# EAGLE design 1u_panel (EAGLE 9.6.2)

## Sheet 1 of 2: MPPT / PWR
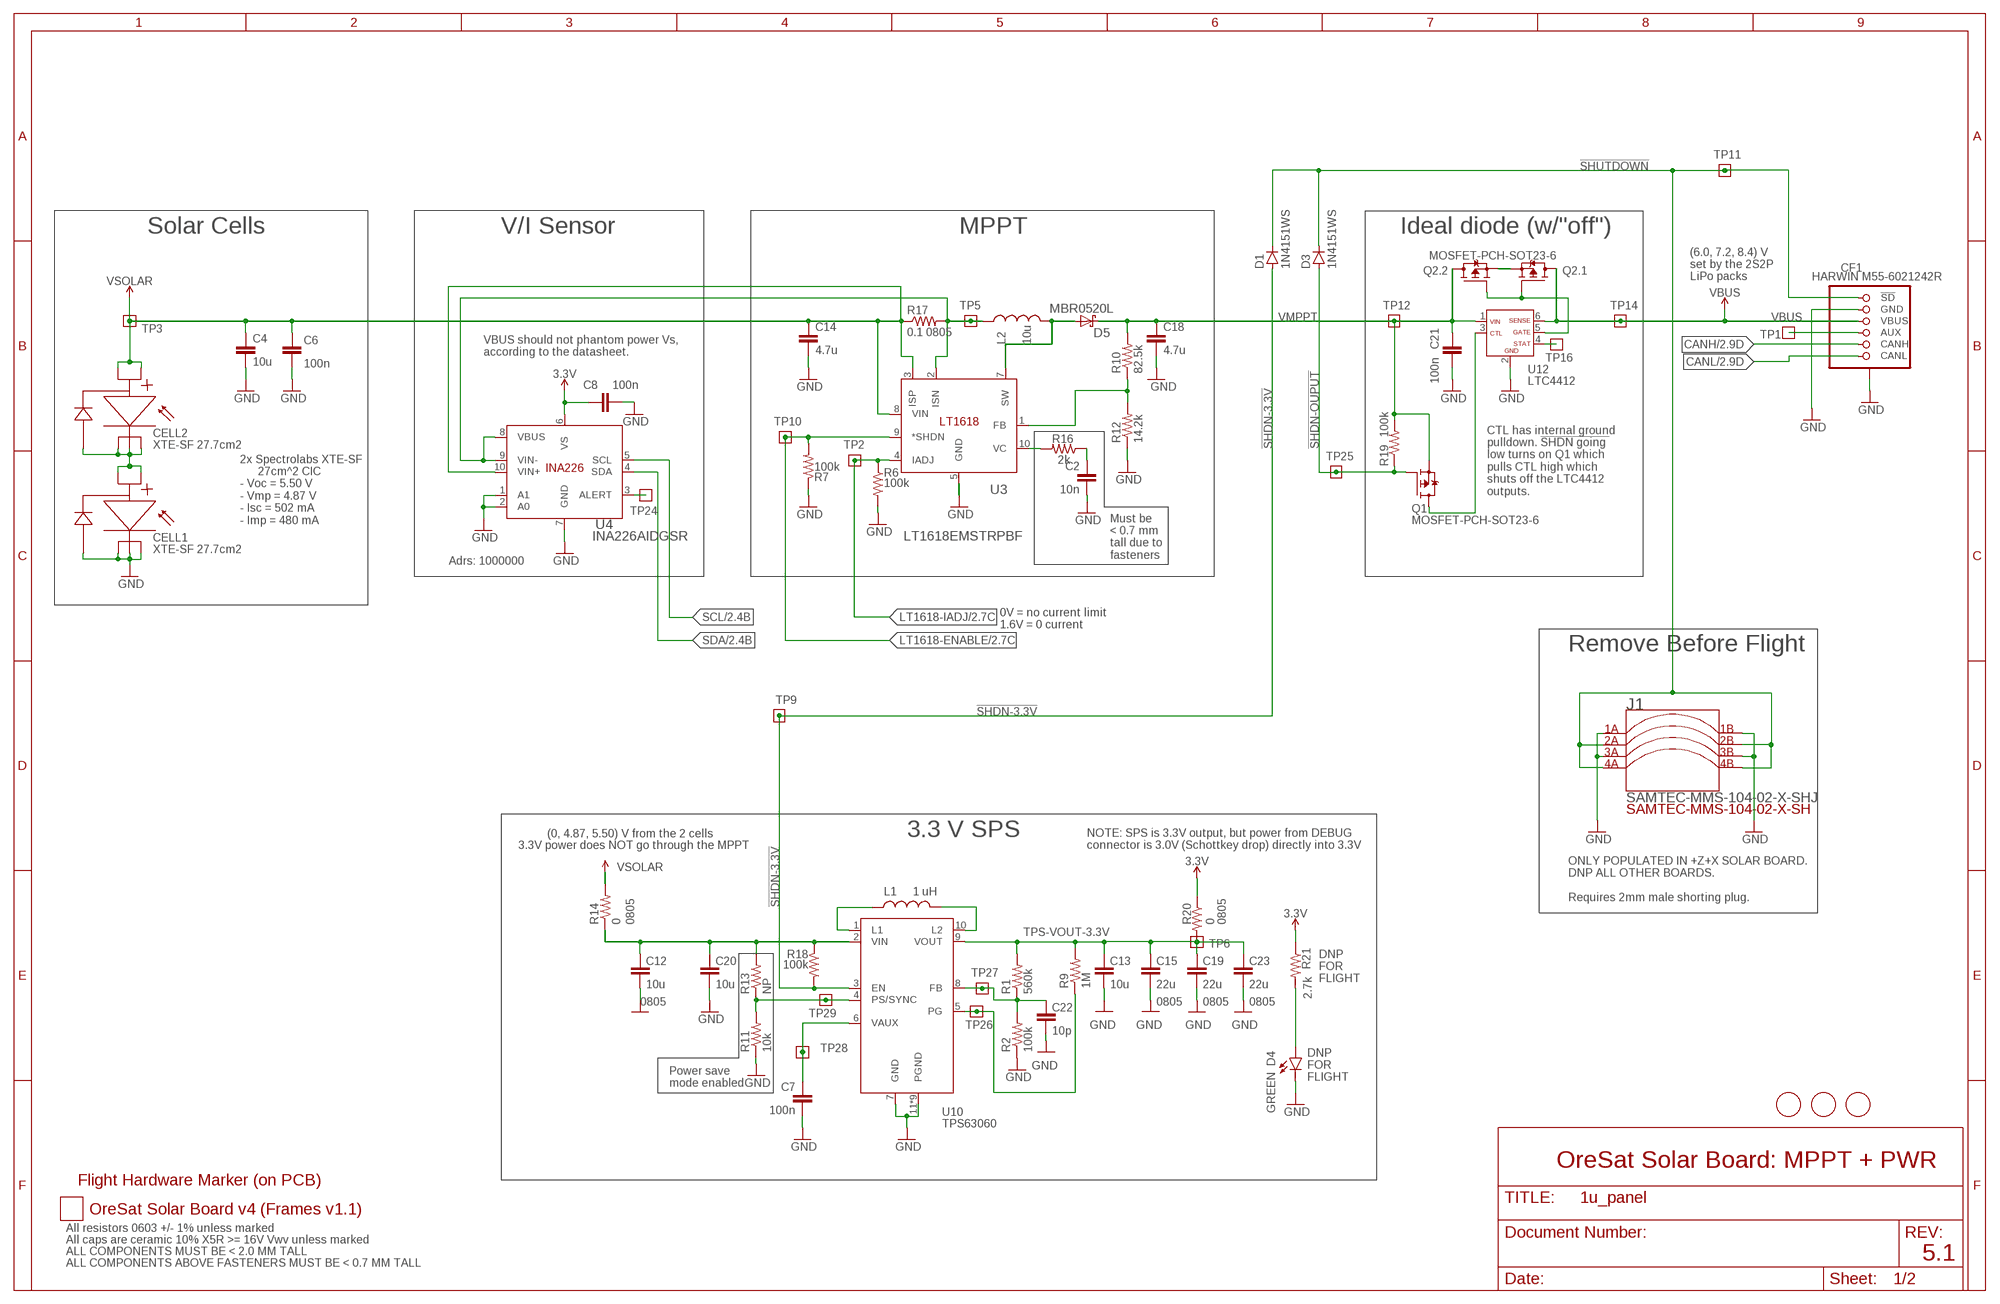
[diagram p0: schematic, sheet 1]

### Parts
C2  10n  C-EU0603-C-NOSILK  [.0603-C-NOSILK]
C4  10u  C-EU0603-C-NOSILK  [.0603-C-NOSILK]
C6  100n  C-EU0603-C-NOSILK  [.0603-C-NOSILK]
C7  100n  C-EU0603-C-NOSILK  [.0603-C-NOSILK]
C8  100n  C-EU0603-C-NOSILK  [.0603-C-NOSILK]
C12  10u  C-EU0805-B-NOSILK  [.0805-B-NOSILK]
C13  10u  C-EU0603-C-NOSILK  [.0603-C-NOSILK]
C14  4.7u  C-EU0603-C-NOSILK  [.0603-C-NOSILK]
C15  22u  C-EU0805-B-NOSILK  [.0805-B-NOSILK]
C18  4.7u  C-EU0603-C-NOSILK  [.0603-C-NOSILK]
C19  22u  C-EU0805-B-NOSILK  [.0805-B-NOSILK]
C20  10u  C-EU0603-C-NOSILK  [.0603-C-NOSILK]
C21  100n  C-EU0402-B-NOSILK  [.0402-B-NOSILK]
C22  10p  C-EU0603-C-NOSILK  [.0603-C-NOSILK]
C23  22u  C-EU0805-B-NOSILK  [.0805-B-NOSILK]
CELL1  XTE-SF 27.7cm2  SPECTROLAB-XTE-SF  [SPECTROLAB-XTE-SF]
CELL2  XTE-SF 27.7cm2  SPECTROLAB-XTE-SF  [SPECTROLAB-XTE-SF]
CF1  HARWIN M55-6021242R  SOLAR-BOARD-CONNECTOR  [HARWIN-M55-60X1242R]
D1  1N4151WS  DIODE-SOD323-R  [SOD323-R]
D3  1N4151WS  DIODE-SOD323-R  [SOD323-R]
D4  GREEN  LED-GREEN0603  [LED-0603]
D5  MBR0520L  NRVB130TGSOD123  [SOD123]
J1  SAMTEC-MMS-104-02-X-SHJ  [SAMTEC-MMS-104-02-X-SH]
L1  1 uH  L-MURATA-1226AS-H-1R0N=P2  [IND_1226AS-H-1R0N=P2]
L2  10u  L-WURTH-744042100  [NONSTANDARD]
PCB1  ORESAT-SOLAR-BOARD-V4-SPECTROLABS  [ORESAT-SOLAR-BOARD-V4]
Q1  MOSFET-PCH-SOT23-6  [SOT23-6]
Q2  MOSFET-PCH-SOT23-6  [SOT23-6]
R1  560k  R-US_0603-C-NOSILK  [.0603-C-NOSILK]
R2  100k  R-US_0603-C-NOSILK  [.0603-C-NOSILK]
R6  100k  R-US_0603-C-NOSILK  [.0603-C-NOSILK]
R7  100k  R-US_0603-C-NOSILK  [.0603-C-NOSILK]
R9  1M  R-US_0603-C-NOSILK  [.0603-C-NOSILK]
R10  82.5k  R-US_0603-C-NOSILK  [.0603-C-NOSILK]
R11  10k  R-US_0603-C-NOSILK  [.0603-C-NOSILK]
R12  14.2k  R-US_0603-C-NOSILK  [.0603-C-NOSILK]
R13  NP  R-US_0603-C-NOSILK  [.0603-C-NOSILK]
R14  0  R-US_0805-C-NOSILK  [.0805-C-NOSILK]
R16  2k  R-US_0603-C-NOSILK  [.0603-C-NOSILK]
R17  0.1 0805  R-US_0805-C-NOSILK  [.0805-C-NOSILK]
R18  100k  R-US_0603-C-NOSILK  [.0603-C-NOSILK]
R19  100k  R-US_0603-C-NOSILK  [.0603-C-NOSILK]
R20  0  R-US_0805-C-NOSILK  [.0805-C-NOSILK]
R21  2.7k  R-US_0603-C-NOSILK  [.0603-C-NOSILK]
TP1  TEST-POINT-LARGE-SQUARE  [1X01]
TP2  TEST-POINT-LARGE-SQUARE  [1X01]
TP3  TEST-POINT-LARGE-SQUARE  [1X01]
TP5  TEST-POINT-LARGE-SQUARE  [1X01]
TP6  TEST-POINT-LARGE-SQUARE  [1X01]
TP9  TEST-POINT-LARGE-SQUARE  [1X01]
TP10  TEST-POINT-LARGE-SQUARE  [1X01]
TP11  TEST-POINT-LARGE-SQUARE  [1X01]
TP12  TEST-POINT-LARGE-SQUARE  [1X01]
TP14  TEST-POINT-LARGE-SQUARE  [1X01]
TP16  TEST-POINT-LARGE-SQUARE  [1X01]
TP24  TEST-POINT-LARGE-SQUARE  [1X01]
TP25  TEST-POINT-LARGE-SQUARE  [1X01]
TP26  TEST-POINT-LARGE-SQUARE  [1X01]
TP27  TEST-POINT-LARGE-SQUARE  [1X01]
TP28  TEST-POINT-LARGE-SQUARE  [1X01]
TP29  TEST-POINT-LARGE-SQUARE  [1X01]
U3  LT1618EMSTRPBF  [MSOP-10_MS]
U4  INA226AIDGSR  [DGS10]
U10  TPS63060  U-TI-TPS63060DCT-BUCKBOOST  [CONV_TPS63060DSCT]
U12  LTC4412  [SOT23-6]
U$1  FLIGHMARKERNEW  [FLIGHTMARKER_NEW_BOARDS]
U$2  FIDUCIAL  [FIDUCIAL_1MM]
U$3  FIDUCIAL  [FIDUCIAL_1MM]
U$4  FIDUCIAL  [FIDUCIAL_1MM]

### Nets
3.3V: C8.1 R20.1 R21.1 U4.6(VS) ; also sheet 2
4412-CTL: Q1.1(D) Q1.2(D) Q1.5(D) Q1.6(D) U12.3(CTL)
4412-GATE: Q2.1(.1:G) Q2.3(.2:G) U12.5(GATE)
!SHDN-3.3V: D1.A R18.2 TP9.1 U10.3(EN)
!SHDN-OUPUT: D3.A Q1.3(G) R19.1 TP25.1
!SHUTDOWN: CF1.1(!SD) CF1.2(!SD) D1.C D3.C J1.2A J1.2B J1.4A J1.4B TP11.1
AUX: CF1.7(AUX) CF1.8(AUX) TP1.1
CANH: CF1.9(CANH) CF1.10(CANH) ; also sheet 2
CANL: CF1.11(CANL) CF1.12(CANL) ; also sheet 2
GND: C2.2 C4.2 C6.2 C7.2 C8.2 C12.2 C13.2 C14.2 C15.2 C18.2 C19.2 C20.2 C21.2 C22.2 C23.2 CELL1.NEG1(C1) CELL1.NEG2(C2) CELL1.NEG3(C3) CELL1.NEG4(C4) CF1.3(GND) CF1.4(GND) CF1.P$1(SHIELD) CF1.P$2(SHIELD) CF1.P$3(SHIELD) CF1.P$4(SHIELD) D4.C J1.1A J1.1B J1.3A J1.3B R2.1 R6.2 R7.1 R11.1 R12.1 U3.5(GND) U4.1(A1) U4.2(A0) U4.7(GND) U10.7(GND) U10.11(PGND) U10.12(PGND) U10.13(PGND) U10.14(PGND) U10.15(PGND) U10.16(PGND) U10.17(PGND) U10.18(PGND) U10.19(PGND) U12.2(GND) ; also sheet 2
INTERCELL: CELL1.POS1(A1) CELL1.POS2(A2) CELL2.NEG1(C1) CELL2.NEG2(C2) CELL2.NEG3(C3) CELL2.NEG4(C4)
LT1618-ENABLE: R7.2 TP10.1 U3.9(*SHDN) ; also sheet 2
LT1618-FB: R10.1 R12.2 U3.1(FB)
LT1618-IADJ: R6.1 TP2.1 U3.4(IADJ) ; also sheet 2
LT1618-ISN: L2.P$1 R17.2 TP5.1 U3.2(ISN) U4.8(VBUS) U4.9(VIN-)
LT1618-SW: D5.A(ANODE) L2.P$2 U3.7(SW)
LT1618-VC: R16.2 U3.10(VC)
N$7: TP24.1 U4.3(ALERT)
N$10: C2.1 R16.1
N$11: TP16.1 U12.4(STAT)
N$13: Q2.2(.2:S) Q2.5(.1:S)
N$14: D4.A R21.2
SCL: U4.5(SCL) ; also sheet 2
SDA: U4.4(SDA) ; also sheet 2
TPS-EN: R11.2 R13.1 TP29.1 U10.4(PS/SYNC)
TPS-FB: C22.1 R1.1 R2.2 TP27.1 U10.8(FB)
TPS-L1: L1.1 U10.1(L1)
TPS-L2: L1.2 U10.10(L2)
TPS-PG: R9.1 TP26.1 U10.5(PG)
TPS-VAUX: C7.1 TP28.1 U10.6(VAUX)
TPS-VIN: C12.1 C20.1 R13.2 R14.1 R18.1 U10.2(VIN)
TPS-VOUT-3.3V: C13.1 C15.1 C19.1 C23.1 R1.2 R9.2 R20.2 TP6.1 U10.9(VOUT)
VBUS: CF1.5(VBUS) CF1.6(VBUS) Q2.6(.1:D) TP14.1 U12.6(SENSE)
VMPPT: C18.1 C21.1 D5.K(CATHODE) Q1.4(S) Q2.4(.2:D) R10.2 R19.2 TP12.1 U12.1(VIN)
VSOLAR: C4.1 C6.1 C14.1 CELL2.POS1(A1) CELL2.POS2(A2) R14.2 R17.1 TP3.1 U3.3(ISP) U3.8(VIN) U4.10(VIN+)

### Notes on the sheet
- Solar Cells | V/I Sensor | MPPT | Ideal diode (w/"off")
- (6.0, 7.2, 8.4) V
  set by the 2S2P 
  LiPo packs
- VBUS should not phantom power Vs,
  according to the datasheet.
- CTL has internal ground
  pulldown. !SHDN going 
  low turns on Q1 which 
  pulls CTL high which 
  shuts off the LTC4412 
  outputs.
- 2x Spectrolabs XTE-SF 
        27cm^2 CIC
  - Voc = 5.50 V
  - Vmp = 4.87 V
  - Isc = 502 mA
  - Imp = 480 mA
- Must be 
  < 0.7 mm
  tall due to
  fasteners
- Adrs: 1000000
- 0V = no current limit
  1.6V = 0 current
- Remove Before Flight
- (0, 4.87, 5.50) V from the 2 cells | 3.3 V SPS
- 3.3V power does NOT go through the MPPT
- NOTE: SPS is 3.3V output, but power from DEBUG
  connector is 3.0V (Schottkey drop) directly into 3.3V
- ONLY POPULATED IN +Z+X SOLAR BOARD.
  DNP ALL OTHER BOARDS.
  
  Requires 2mm male shorting plug.
- 0805 | 0805
- DNP
  FOR
  FLIGHT
- 0805 | 0805 | 0805 | 0805
- DNP
  FOR
  FLIGHT
- Power save
  mode enabled
- OreSat Solar Board: MPPT + PWR
- All resistors 0603 +/- 1% unless marked
- All caps are ceramic 10% X5R >= 16V Vwv unless marked
- ALL COMPONENTS MUST BE < 2.0 MM TALL
- 5.1
- ALL COMPONENTS ABOVE FASTENERS MUST BE < 0.7 MM TALL

## Sheet 2 of 2: Microcontroller
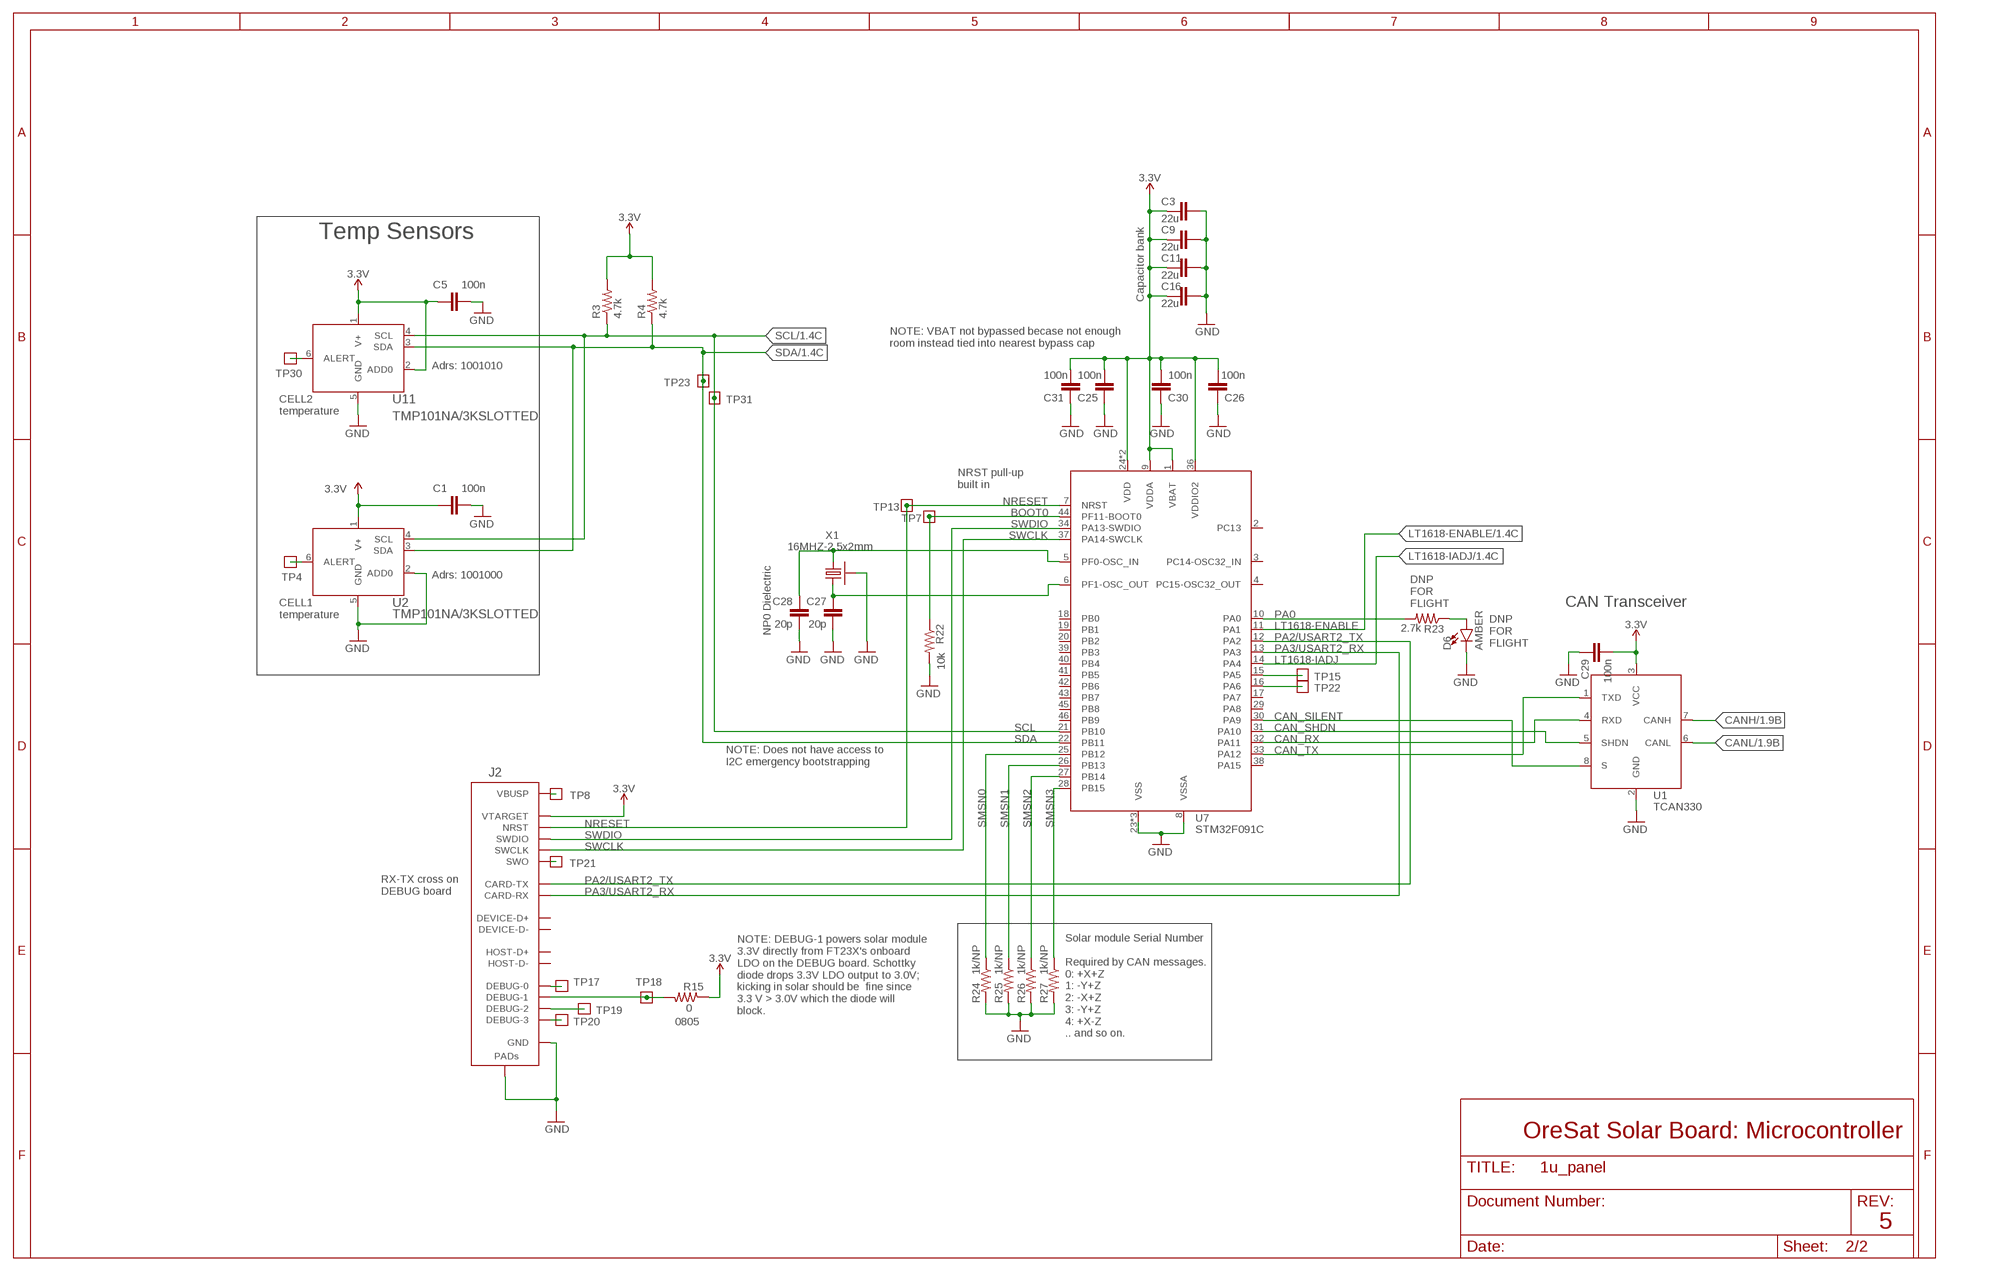
[diagram p1: schematic, sheet 2]

### Parts
C1  100n  C-EU0603-C-NOSILK  [.0603-C-NOSILK]
C3  22u  C-EU0805-B-NOSILK  [.0805-B-NOSILK]
C5  100n  C-EU0603-C-NOSILK  [.0603-C-NOSILK]
C9  22u  C-EU0805-B-NOSILK  [.0805-B-NOSILK]
C11  22u  C-EU0805-B-NOSILK  [.0805-B-NOSILK]
C16  22u  C-EU0805-B-NOSILK  [.0805-B-NOSILK]
C25  100n  C-EU0603-C-NOSILK  [.0603-C-NOSILK]
C26  100n  C-EU0603-C-NOSILK  [.0603-C-NOSILK]
C27  20p  C-EU0603-C-NOSILK  [.0603-C-NOSILK]
C28  20p  C-EU0603-C-NOSILK  [.0603-C-NOSILK]
C29  100n  C-EU0603-C-NOSILK  [.0603-C-NOSILK]
C30  100n  C-EU0603-C-NOSILK  [.0603-C-NOSILK]
C31  100n  C-EU0603-C-NOSILK  [.0603-C-NOSILK]
D6  AMBER  LED-GREEN0603  [LED-0603]
J2  ORESAT-DEBUG-CONNECTOR-ALL  [TE_2-1734592-0]
R3  4.7k  R-US_0603-C-NOSILK  [.0603-C-NOSILK]
R4  4.7k  R-US_0603-C-NOSILK  [.0603-C-NOSILK]
R15  0  R-US_0805-C-NOSILK  [.0805-C-NOSILK]
R22  10k  R-US_0603-C-NOSILK  [.0603-C-NOSILK]
R23  2.7k  R-US_0603-C-NOSILK  [.0603-C-NOSILK]
R24  1k/NP  R-US_0603-C-NOSILK  [.0603-C-NOSILK]
R25  1k/NP  R-US_0603-C-NOSILK  [.0603-C-NOSILK]
R26  1k/NP  R-US_0603-C-NOSILK  [.0603-C-NOSILK]
R27  1k/NP  R-US_0603-C-NOSILK  [.0603-C-NOSILK]
TP4  TEST-POINT-LARGE-SQUARE  [1X01]
TP7  TEST-POINT-LARGE-SQUARE  [1X01]
TP8  TEST-POINT-LARGE-SQUARE  [1X01]
TP13  TEST-POINT-LARGE-SQUARE  [1X01]
TP15  TEST-POINT-LARGE-SQUARE  [1X01]
TP17  TEST-POINT-LARGE-SQUARE  [1X01]
TP18  TEST-POINT-LARGE-SQUARE  [1X01]
TP19  TEST-POINT-LARGE-SQUARE  [1X01]
TP20  TEST-POINT-LARGE-SQUARE  [1X01]
TP21  TEST-POINT-LARGE-SQUARE  [1X01]
TP22  TEST-POINT-LARGE-SQUARE  [1X01]
TP23  TEST-POINT-LARGE-SQUARE  [1X01]
TP30  TEST-POINT-LARGE-SQUARE  [1X01]
TP31  TEST-POINT-LARGE-SQUARE  [1X01]
U1  TCAN330  [SOT23-8_TI-DCN]
U2  TMP101NA/3KSLOTTED  [DBV6-SLOT]
U7  STM32F091C  [STM32F091C]
U11  TMP101NA/3KSLOTTED  [DBV6-SLOT]
X1  16MHZ-2.5x2mm  CRYSTAL-WITH-GND  [CRYSTAL_2.5X2]

### Nets
3.3V: C1.1 C3.1 C5.1 C9.1 C11.1 C16.1 C25.2 C26.2 C29.2 C30.2 C31.2 J2.11(VTARGET) R3.2 R4.2 R15.1 U1.3(VCC) U2.1(V+) U7.1(VBAT) U7.9(VDDA) U7.24(VDD) U7.36(VDDIO2) U7.48(VDD) U11.1(V+) U11.2(ADD0) ; also sheet 1
BOOT0: R22.1 TP7.1 U7.44(PF11-BOOT0)
CAN_RX: U1.4(RXD) U7.32(PA11)
CAN_SHDN: U1.5(SHDN) U7.31(PA10)
CAN_SILENT: U1.8(S) U7.30(PA9)
CAN_TX: U1.1(TXD) U7.33(PA12)
CANH: U1.7(CANH) ; also sheet 1
CANL: U1.6(CANL) ; also sheet 1
DEBU-1/SOLAR3V: J2.18(DEBUG-1) R15.2 TP18.1
DEBUG-0: J2.17(DEBUG-0) TP17.1
DEBUG-2: J2.19(DEBUG-2) TP19.1
DEBUG-3: J2.20(DEBUG-3) TP20.1
GND: C1.2 C3.2 C5.2 C9.2 C11.2 C16.2 C25.1 C26.1 C27.2 C28.2 C29.1 C30.1 C31.1 D6.C J2.3(GND) J2.6(GND) J2.9(GND) J2.PAD1(PAD) J2.PAD2(PAD) R22.2 R24.2 R25.2 R26.2 R27.2 U1.2(GND) U2.2(ADD0) U2.5(GND) U7.8(VSSA) U7.23(VSS) U7.35(VSS) U7.47(VSS) U11.5(GND) X1.2(SHIELD) X1.4(SHIELD) ; also sheet 1
LT1618-ENABLE: U7.11(PA1) ; also sheet 1
LT1618-IADJ: U7.14(PA4) ; also sheet 1
N$1: J2.1(VBUSP) J2.2(VBUSP) TP8.1
N$2: TP4.1 U2.6(ALERT)
N$9: TP30.1 U11.6(ALERT)
N$19: D6.A R23.1
NRESET: J2.10(NRST) TP13.1 U7.7(NRST)
PA0: R23.2 U7.10(PA0)
PA2/USART2_TX: J2.13(CARD-TX) U7.12(PA2)
PA3/USART2_RX: J2.12(CARD-RX) U7.13(PA3)
PA5: TP15.1 U7.15(PA5)
PA6: TP22.1 U7.16(PA6)
SCL: R3.1 TP31.1 U2.4(SCL) U7.21(PB10) U11.4(SCL) ; also sheet 1
SDA: R4.1 TP23.1 U2.3(SDA) U7.22(PB11) U11.3(SDA) ; also sheet 1
SMSN0: R24.1 U7.25(PB12)
SMSN1: R25.1 U7.26(PB13)
SMSN2: R26.1 U7.27(PB14)
SMSN3: R27.1 U7.28(PB15)
SWCLK: J2.15(SWCLK) U7.37(PA14-SWCLK)
SWDIO: J2.14(SWDIO) U7.34(PA13-SWDIO)
SWO: J2.16(SWO) TP21.1
XTAL1-IN: C28.1 U7.5(PF0-OSC_IN) X1.1
XTAL1-OUT: C27.1 U7.6(PF1-OSC_OUT) X1.3
Unconnected: J2.4(DEVICE-D+) J2.5(DEVICE-D-) J2.7(HOST-D+) J2.8(HOST-D-) U7.2(PC13) U7.3(PC14-OSC32_IN) U7.4(PC15-OSC32_OUT) U7.17(PA7) U7.18(PB0) U7.19(PB1) U7.20(PB2) U7.29(PA8) U7.38(PA15) U7.39(PB3) U7.40(PB4) U7.41(PB5) U7.42(PB6) U7.43(PB7) U7.45(PB8) U7.46(PB9)

### Notes on the sheet
- Temp Sensors
- Capacitor bank
- NOTE: VBAT not bypassed becase not enough 
  room instead tied into nearest bypass cap
- Adrs: 1001010
- CELL2
  temperature
- NRST pull-up
  built in
- Adrs: 1001000
- CAN Transceiver
- DNP
  FOR
  FLIGHT
- CELL1
  temperature
- NP0 Dielectric
- DNP
  FOR
  FLIGHT
- NOTE: Does not have access to 
  I2C emergency bootstrapping
- RX-TX cross on
  DEBUG board
- NOTE: DEBUG-1 powers solar module 
  3.3V directly from FT23X's onboard 
  LDO on the DEBUG board. Schottky 
  diode drops 3.3V LDO output to 3.0V;
  kicking in solar should be  fine since 
  3.3 V > 3.0V which the diode will 
  block.
- 0805
- Solar module Serial Number
  
  Required by CAN messages.
  0: +X+Z
  1: -Y+Z
  2: -X+Z
  3: -Y+Z
  4: +X-Z
  .. and so on.
- OreSat Solar Board: Microcontroller
- 5

## Library data of the parts
C1 C5-C8 C25 C26 C29-C31 = oresat-rcl:C-EU: CAPACITOR, European symbol; DIS: Digi-Key; DPN: 1276-6985-1-ND; MFR: Kemet; MPN: CL10B104KB85PND
C2 = oresat-rcl:C-EU: CAPACITOR, European symbol; DIS: Digi-Key; DPN: 587-5957-1-ND; MFR: Taiyo; MPN: UMK107B7103KAHT
C3 C9 C11 C15 C16 C19 C23 = oresat-rcl:C-EU: CAPACITOR, European symbol; DIS: Digi-Key; DPN: 1276-6817-1-ND; MFR: Samsung; MPN: CL32B226KOJVPNE
C4 C13 C20 C22 = oresat-rcl:C-EU: CAPACITOR, European symbol; DIS: Digi-Key; DPN: 490-12317-1-ND; MFR: Murata; MPN: GRT188R61C106KE13D
C12 = oresat-rcl:C-EU: CAPACITOR, European symbol; DIS: Digi-Key; DPN: 490-12379-2-ND; MFR: Murata; MPN: GRT21BR61C106KE01L
C14 C18 = oresat-rcl:C-EU: CAPACITOR, European symbol; DIS: Digi-Key; DPN: 587-4332-1-ND; MFR: Taiyo; MPN: EMK107BBJ475KAHT
C21 = rcl_custom:C-EU: CAPACITOR, European symbol; DIS: Digi-Key; DPN: 1276-6985-1-ND; MFR: Kemet; MPN: CL10B104KB85PND
C27 C28 = oresat-rcl:C-EU: CAPACITOR, European symbol; DIS: Digi-Key; DPN: 490-11157-2-ND; MFR: Murata; MPN: GCM1885C2A200JA16D
CELL1 CELL2 = D-Spectrolab-XTE-SF:SPECTROLAB-XTE-SF
CF1 = J-Harwin-M55-60X1242R-Solar-board-connector:SOLAR-BOARD-CONNECTOR: OreSat Solar Board Connector This 12 pin 1.27 mm vertical connector (Harwin M55-6021242R) is used on the OreSat 1U solar panels to connect to the end cards.; DIS: DIGIKEY; DPN: M55-6021242R; MFR: HARWIN; MPN: M55-6021242R
D1 D3 = D-Generic-silicon-SOD-323:DIODE-: DIODE
D4 = SparkFun-LED:LED-GREEN: Green SMD LED Used in manufacturing of various products at SparkFun Packages: 0603 - SMD 0603 package [Product Link] <http://www.futureelectronics.com/en/technologies/semiconductors/optoelectronics/leds/Pages/9894312-LTST-C190GKT.aspx?CrossPart=HSMG-C190&IM=0> LilyPad 1206 - SMD1206 LilyPad package [Product Link] <http://www.futureelectronics.com/en/Technologies/Product.aspx?ProductID=IN150NGHARVATEKCORPORATION2049943&IM=0> 1206 - SMD1206 package [Product Link] <http://www.futureelectronics.com/en/technologies/semiconductors/optoelectronics/leds/Pages/8315665-LTST-C150KGKT.aspx?IM=0> 1206 Bottom Mount -SMD 1206 Bottom Mount [Product Link] <http://www.digikey.com/product-detail/en/lite-on-inc/LTST-C230KGKT/160-1456-1-ND/386854> SparkFun Products: Pro Mini 328 -5V <https://www.sparkfun.com/products/821> RedBoard <https://www.sparkfun.com/products/12757> MP3 Trigger <https://www.sparkfun.com/products/13720> Makey Makey <https://www.sparkfun.com/products/11076>; DIS: Digi-Key; DPN: 1830-1064-1-ND; MFR: Inolux; MPN: IN-S63AT5A
D5 = D-OnSemi-NRVB130T3G:NRVB130TGSOD123: OnSemi schottky diode, 350mV, 1A, SOD123; DIS: Digi-Key; DPN: NRVB130T3GOSCT-ND; MFR: OnSemi; MPN: NRVB130T3G
D6 = SparkFun-LED:LED-GREEN: Green SMD LED Used in manufacturing of various products at SparkFun Packages: 0603 - SMD 0603 package [Product Link] <http://www.futureelectronics.com/en/technologies/semiconductors/optoelectronics/leds/Pages/9894312-LTST-C190GKT.aspx?CrossPart=HSMG-C190&IM=0> LilyPad 1206 - SMD1206 LilyPad package [Product Link] <http://www.futureelectronics.com/en/Technologies/Product.aspx?ProductID=IN150NGHARVATEKCORPORATION2049943&IM=0> 1206 - SMD1206 package [Product Link] <http://www.futureelectronics.com/en/technologies/semiconductors/optoelectronics/leds/Pages/8315665-LTST-C150KGKT.aspx?IM=0> 1206 Bottom Mount -SMD 1206 Bottom Mount [Product Link] <http://www.digikey.com/product-detail/en/lite-on-inc/LTST-C230KGKT/160-1456-1-ND/386854> SparkFun Products: Pro Mini 328 -5V <https://www.sparkfun.com/products/821> RedBoard <https://www.sparkfun.com/products/12757> MP3 Trigger <https://www.sparkfun.com/products/13720> Makey Makey <https://www.sparkfun.com/products/11076>; DIS: Digi-Key; DPN: 1830-1064-1-ND; MFR: Inolux; MPN: IN-S63AT5A; VALUE: GREEN
J1 = J-Samtec-MMS-104-02-X-SH-smt-0.1-ra:SAMTEC-MMS-104-02-X-SH
J2 = oresat-debug-connector:ORESAT-DEBUG-CONNECTOR; DIS: Digi-Key; DPN: 732-11341-1-ND; MFR: Wurth; MPN: 687120183622
L1 = L-Wurth-1226ASH1R0NP2:L-MURATA-1226AS-H-1R0N=P2; DIS: Digi-Key; DPN: 445-VLS3010CX-1R5M-1CT-ND; MFR: TDK; MPN: VLS3010CX-1R5M-1
L2 = Wurth-744042100:L-WURTH-744042100; DIS: Digi-Key; DPN: 732-1025-1-ND; MFR: WURTH; MPN: 744042100
PCB1 = oresat-solar-board:ORESAT-SOLAR-BOARD-V4
Q1 = Q-MOSFET-PCH-SOT23-6:MOSFET-PCH-SOT23-6: P channel MOSFET in an SOT23-6; DIS: Digi-Key; DPN: DMP3050LVT-7DICT-ND; MFR: Diodes Inc.; MPN: DMP3050LVT-7
Q2 = Q-MOSFET-PCH-dual-SOT23-6:MOSFET-PCH-SOT23-6: Dual P channel MOSFETs in an SOT23-6; DIS: Digi-Key; DPN: DMP2240UDMDICT-ND; MFR: Diodes Inc.; MPN: DMP2240UDM-7
R1 = oresat-rcl:R-US_: RESISTOR, American symbol; DIS: Digi-Key; DPN: A129720CT-ND; MFR: TE; MPN: CRGCQ0603F470K
R2 = oresat-rcl:R-US_: RESISTOR, American symbol; DIS: Digi-Key; DPN: RR08P100KDCT-ND; MFR: Susumu; MPN: RR0816P-104-D
R3 R4 = oresat-rcl:R-US_: RESISTOR, American symbol; DIS: Digi-Key; DPN: 13-RE0603FRE074K7LCT-ND; MFR: Yageo; MPN: RE0603FRE074K7L
R6 R7 R13 R18 R19 = oresat-rcl:R-US_: RESISTOR, American symbol; DIS: Digi-Key; DPN: RNCP0603FTD10K0CT-ND; MFR: Stackpole; MPN: RNCP0603FTD10K0
R9 R11 = oresat-rcl:R-US_: RESISTOR, American symbol
R10 = oresat-rcl:R-US_: RESISTOR, American symbol; DIS: Digi-Key; DPN: P82.5KDBCT-ND; MFR: Panasonic; MPN: ERA-3AEB8252V
R12 = oresat-rcl:R-US_: RESISTOR, American symbol; DIS: Digi-Key; DPN: 2019-RN73R1JTTD1422D25CT-ND; MFR: KOA; MPN: RN73R1JTTD1422D25
R14 R15 R17 R20 = oresat-rcl:R-US_: RESISTOR, American symbol; DIS: Digi-Key; DPN: RMCF0805ZT0R00CT-ND; MFR: Stackpole; MPN: RMCF0805ZT0R00
R16 = oresat-rcl:R-US_: RESISTOR, American symbol; DIS: Digi-Key; DPN: 2019-RK73H1JTTD2001FCT-ND; MFR: KOA; MPN: RK73H1JTTD2001F
R21-R23 = oresat-rcl:R-US_: RESISTOR, American symbol; DIS: Digi-Key; DPN: A129693CT-ND; MFR: TE; MPN: CRGCQ0603F2K7
R24-R27 = oresat-rcl:R-US_: RESISTOR, American symbol; DIS: Digi-Key; DPN: 118-CR0603AFX-1001ELFCT-ND; MFR: Bourns; MPN: CR0603AFX-1001ELF
TP1-TP31 = oresat-misc:TEST-POINT-LARGE-SQUARE
U1 = TCAN330:TCAN330; DIS: Digi-Key; DPN: 296-44211-1-ND; MFR: Texas Instruments; MPN: TCAN330GDCNT
U2 U11 = U-TI-TMP101-TempSensor:TMP101NA/3K; DIS: Digi-Key; DPN: 296-27725-1-ND; MFR: Texas Instruments; MPN: TMP101NA/3K
U3 = U-Linear-LT1618E-Boost:LT1618EMSTRPBF; DESCRIPTION: PMIC - DC/DC voltage regulator Linear Technology LT1618EMS#TRPBF Converter, Boost, Converter/amplifier, SEPIC MSOP 10; DIGI-KEY_PART_NUMBER: LT1618EMS#TRPBFCT-ND; DIGI-KEY_PURCHASE_URL: https://www.digikey.com/product-detail/en/linear-technology-analog-devices/LT1618EMS-TRPBF/LT1618EMS-TRPBFCT-ND/3885220?utm_source=snapeda&utm_medium=aggregator&utm_campaign=symbol; DIS: Digi-Key; DPN: LT1618EMS#TRPBFCT-ND; MF: Linear Technology/Analog; MFR: Linear Technologies; MP: LT1618EMS#TRPBF; MPN: LT1618EMS#TRPBF; PACKAGE: MSOP-10 Linear Technology
U4 = U-TI-INA226AIDGSR-CurrentMonitor:INA226AIDGSR; DIS: Digi-Key; DPN: 296-29034-1-ND; MANUFACTURER_PART_NUMBER: INA226AIDGSR; MFR: TI; MPN: INA226AIDGSR; VENDOR: Texas Instruments
U7 = U-ST-STM32F091C-uC:STM32F091C; DIS: Digi-Key; DPN: 497-18749-1-ND; MFR: STMicroelectronics; MPN: STM32F091CCT6TR
U10 = U-TI-TPS63060DSCT-buck-boost:U-TI-TPS63060DCT-BUCKBOOST
U12 = U-Linear-LTC4412-Ideal-Diode:LTC4412; DIS: Digi-Key; DPN: LTC4412ES6#TRPBFCT-ND; MFR: Linear Technologies; MPN: LTC4412ES6#TRPBF
U$1 = oresat-flight-marker:FLIGHMARKER
U$2-U$4 = adafruit:FIDUCIAL: For use by pick and place machines to calibrate the vision/machine, 1mm By microbuilder.eu
X1 = low-gain-radio:CRYSTAL-WITH-GND; DIS: Digi-Key; DPN: XC2181CT-ND; MFR: ECS Inc.; MPN: ECS-160-10-36Q-ES-TR

## Board
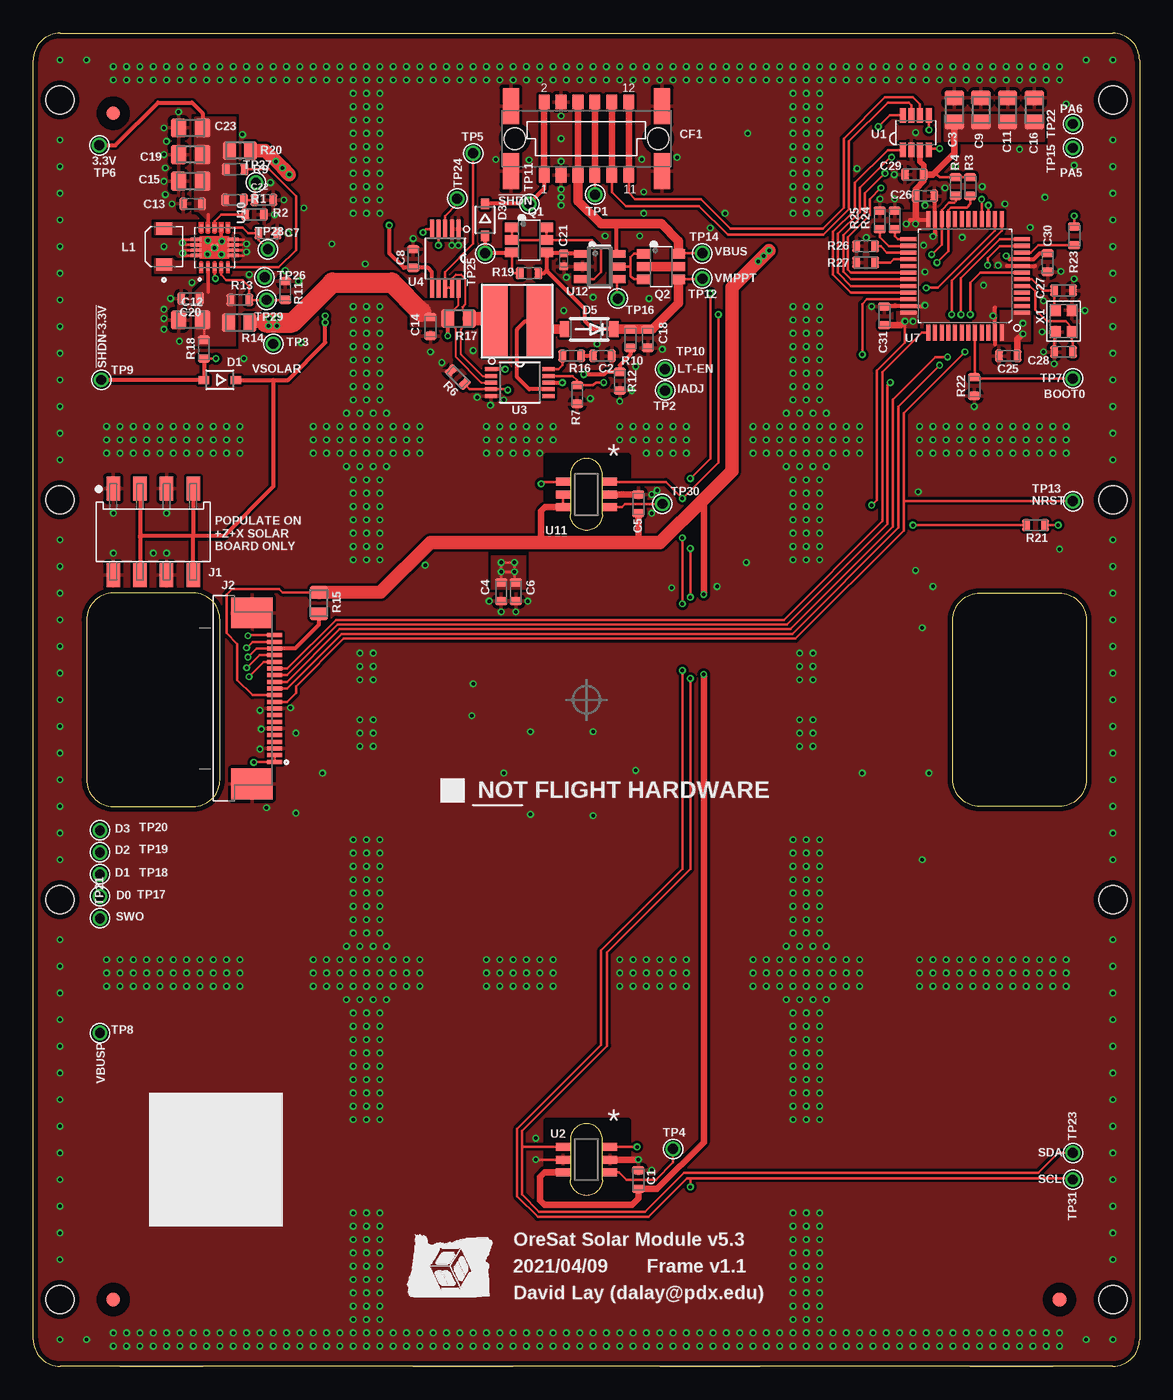
[diagram p2: board, top side]
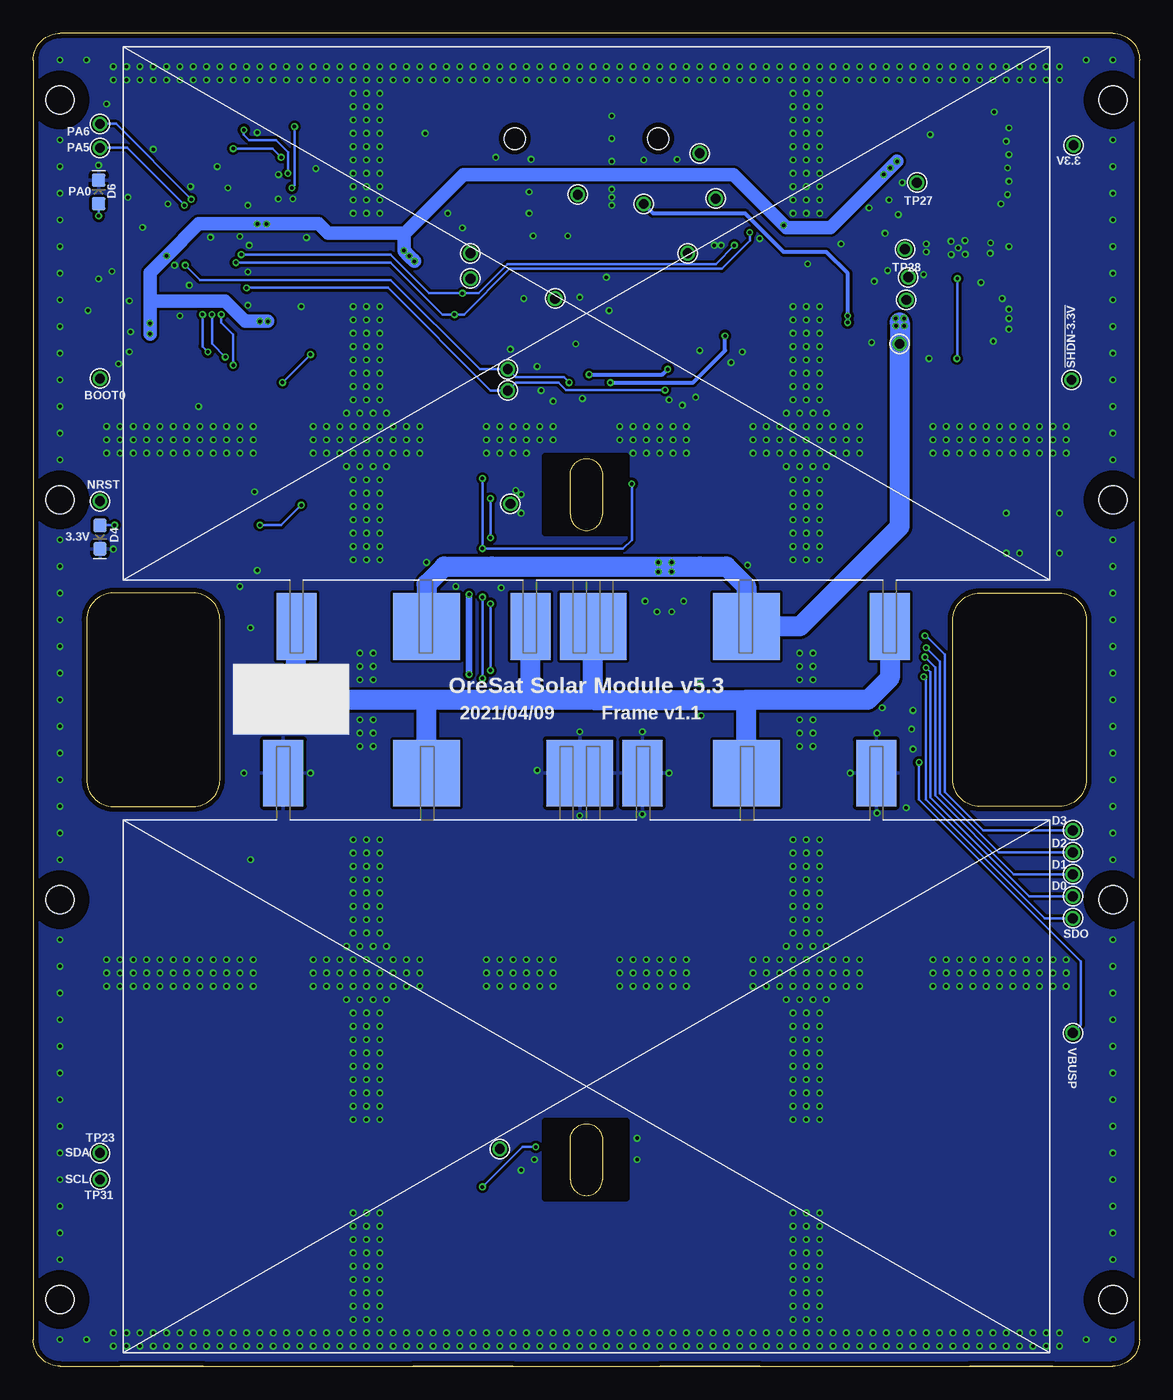
[diagram p3: board, bottom side, seen from below]

Size 83 x 100 mm. Coordinates in mm from the lower left corner, seen from the top.
Copper layers (1*16): Top 0.035559375mm / dielectric 1.6mm / Bottom 0.035559375mm
Design rules "oshpark-2layer-tented": minimum track width 6mil, minimum drill 10mil, track to track 6mil, track to pad 6mil, pad to pad 6mil, via to via 6mil, smd to smd 6mil, copper to edge 15mil, drill to drill 6mil, minimum pad ring 5mil, minimum via ring 5mil, stop-mask expansion 2.5mil, vias tented up to drill 20mil, thermal gap 10mil
tRestrict: 14 lines
bRestrict: 8 lines

### Footprints (pad centres in the part's own frame; a part is rotated, then mirrored left to right if it is on the bottom)
.0603-C-NOSILK = smd 0.6 x 0.9: 1 -0.7,0; 2 0.7,0
.0805-B-NOSILK = smd 1.15 x 1.45: 1 -0.9,0; 2 0.9,0
.0402-B-NOSILK = smd 0.6 x 0.7: 1 -0.5,0; 2 0.5,0
SPECTROLAB-XTE-SF = smd 3 x 5: NEG1 -22.75,23.5; NEG2 21.75,23.5; NEG3 4.2,23.5 | smd 5 x 5: NEG4 -0.5,23.5; POS1 -12,23.5; POS2 12,23.5
HARWIN-M55-60X1242R = smd 0.8 x 1.1: 1 -3.175,-2.75; 2 -3.175,2.75; 3 -1.905,-2.75; 4 -1.905,2.75; 5 -0.635,-2.75; 6 -0.635,2.75; 7 0.635,-2.75; 8 0.635,2.75; 9 1.905,-2.75; 10 1.905,2.75; 11 3.175,-2.75; 12 3.175,2.75 | smd 1.2 x 2.7: P$1 -5.67,-2.45; P$2 -5.67,2.45; P$3 5.67,2.45; P$4 5.67,-2.45 | hole 1.6: -5.385,0; 5.385,0
SOD323-R = smd 0.8 x 0.6: A 1.2,0; C -1.2,0
LED-0603 = smd 1 x 1: A -0.877,0; C 0.877,0
SOD123 = smd 0.7 x 1.2: A 1.85,0; K -1.85,0
SAMTEC-MMS-104-02-X-SH = smd 1.02 x 1.78: 1A -3,3.24; 1B -3,-3.24; 2A -1,3.24; 2B -1,-3.24; 3A 1,3.24; 3B 1,-3.24; 4A 3,3.24; 4B 3,-3.24
TE_2-1734592-0 = smd 0.3 x 1.1: 1 -4.75,-1.7; 2 -4.25,-1.7; 3 -3.75,-1.7; 4 -3.25,-1.7; 5 -2.75,-1.7; 6 -2.25,-1.7; 7 -1.75,-1.7; 8 -1.25,-1.7; 9 -0.75,-1.7; 10 -0.25,-1.7; 11 0.25,-1.7; 12 0.75,-1.7; 13 1.25,-1.7; 14 1.75,-1.7; 15 2.25,-1.7; 16 2.75,-1.7; 17 3.25,-1.7; 18 3.75,-1.7; 19 4.25,-1.7; 20 4.75,-1.7 | smd 2.3 x 3.1: PAD1 6.42,0; PAD2 -6.42,0
IND_1226AS-H-1R0N=P2 = smd 0.9 x 1.2: 1 -1.35,0; 2 1.35,0
NONSTANDARD = smd 2 x 5.3: P$1 -1.7,0; P$2 1.7,0
ORESAT-SOLAR-BOARD-V4 = hole 2.1: 2,5; 2,35; 2,95; 81,5; 81,35; 81,95; 2,65; 81,65
SOT23-6 = smd 0.7 x 1: 1 -0.95,-1.3; 2 0,-1.3; 3 0.95,-1.3; 4 0.95,1.3; 5 0,1.3; 6 -0.95,1.3
.0805-C-NOSILK = smd 0.95 x 1.35: 1 -0.8,0; 2 0.8,0
1X01 = drill 0.737 pad 1.1: 1 0,0
SOT23-8_TI-DCN = smd 0.45 x 1.1: 1 -0.975,-1.3; 2 -0.325,-1.3; 3 0.325,-1.3; 4 0.975,-1.3; 5 0.975,1.3; 6 0.325,1.3; 7 -0.325,1.3; 8 -0.975,1.3
DBV6-SLOT = smd 1.1 x 0.6: 1 1.75,0.95; 2 1.75,0; 3 1.75,-0.95; 4 -1.75,-0.95; 5 -1.75,0; 6 -1.75,0.95
MSOP-10_MS = smd 0.9 x 0.3: 1 -2.165,1; 2 -2.165,0.5; 3 -2.165,0; 4 -2.165,-0.5; 5 -2.165,-1; 6 2.165,-1; 7 2.165,-0.5; 8 2.165,0; 9 2.165,0.5; 10 2.165,1
DGS10 = smd 1.45 x 0.3: 1 -2.2,1; 2 -2.2,0.5; 3 -2.2,0; 4 -2.2,-0.5; 5 -2.2,-1; 6 2.2,-1; 7 2.2,-0.5; 8 2.2,0; 9 2.2,0.5; 10 2.2,1
STM32F091C = smd 0.3 x 1.2: 1 -2.75,-4.25; 2 -2.25,-4.25; 3 -1.75,-4.25; 4 -1.25,-4.25; 5 -0.75,-4.25; 6 -0.25,-4.25; 7 0.25,-4.25; 8 0.75,-4.25; 9 1.25,-4.25; 10 1.75,-4.25; 11 2.25,-4.25; 12 2.75,-4.25; 25 2.75,4.25; 26 2.25,4.25; 27 1.75,4.25; 28 1.25,4.25; 29 0.75,4.25; 30 0.25,4.25; 31 -0.25,4.25; 32 -0.75,4.25; 33 -1.25,4.25; 34 -1.75,4.25; 35 -2.25,4.25; 36 -2.75,4.25 | smd 1.2 x 0.3: 13 4.25,-2.75; 14 4.25,-2.25; 15 4.25,-1.75; 16 4.25,-1.25; 17 4.25,-0.75; 18 4.25,-0.25; 19 4.25,0.25; 20 4.25,0.75; 21 4.25,1.25; 22 4.25,1.75; 23 4.25,2.25; 24 4.25,2.75; 37 -4.25,2.75; 38 -4.25,2.25; 39 -4.25,1.75; 40 -4.25,1.25; 41 -4.25,0.75; 42 -4.25,0.25; 43 -4.25,-0.25; 44 -4.25,-0.75; 45 -4.25,-1.25; 46 -4.25,-1.75; 47 -4.25,-2.25; 48 -4.25,-2.75
CONV_TPS63060DSCT = smd 0.5 x 0.2: 1 -1.475,1; 2 -1.475,0.5; 3 -1.475,0; 4 -1.475,-0.5; 5 -1.475,-1; 6 1.475,-1; 7 1.475,-0.5; 8 1.475,0; 9 1.475,0.5; 10 1.475,1 | smd 0.5 x 0.5: 11 0,0 | smd 0.254 x 0.8: 12 -0.6,1.4; 13 -0.2,1.4; 14 0.2,1.4; 15 0.6,1.4; 16 -0.6,-1.4; 17 -0.2,-1.4; 18 0.2,-1.4; 19 0.6,-1.4
SOT23-6' = smd 0.6 x 1.25: 1 0.95,1.31; 2 0,1.31; 3 -0.95,1.31; 4 -0.95,-1.31; 5 0,-1.31; 6 0.95,-1.31
FIDUCIAL_1MM = smd 1 x 1: 1 0,0
CRYSTAL_2.5X2 = smd 0.9 x 0.8: 1 -0.825,-0.625; 2 0.825,-0.625; 3 0.825,0.625; 4 -0.825,0.625

### Placement (x,y rotation side)
C1  45.4,14 90 top
C2  42.7,75.8 0 top
C3  69.1,94.25 90 top
C4  35.1,58.1 270 top
C5  45.4,64.7 90 top
C6  36.2,58.1 270 top
C7  17.6,85 0 top
C8  28.5,83.1 90 top
C9  71.1,94.25 90 top
C11  73.1,94.25 90 top
C12  11.8,78.5 180 top
C13  11.95,87.2 180 top
C14  29.8,78 270 top
C15  11.8,88.9 180 top
C16  75.1,94.25 90 top
C18  46.1,77.1 270 top
C19  11.8,90.9 180 top
C20  11.8,80.1 180 top
C21  39.8,83 270 top
C22  17.3,87.5 0 top
C23  11.8,92.9 180 top
C25  73.14,75.8 0 top
C26  66.9,87.8 180 top
C27  77.3,80.7 0 top
C28  77.3,76.1 180 top
C29  66.1,89.4 0 top
C30  76.1,82.8 90 top
C31  63.85,78.8 270 top
CELL1  41.5,21 0 bottom
CELL2  41.5,79 180 bottom
CF1  41.5,92.1 0 top
D1  14,74 180 top
D3  33.9,86 270 top
D4  78,62.2 270 bottom
D5  41.7,77.8 180 top
D6  78.1,88.1 90 bottom
J1  9,62.6 0 top
J2  16.4,50.1 90 top
L1  9.8,84 90 top
L2  36.3,78.4 0 top
PCB1  0,0 0 top
Q1  37.2,84.5 270 top
Q2  47.1,82.5 270 top
R1  15.1,87.5 180 top
R2  16.6,86.4 180 top
R3  70.3,88.5 90 top
R4  69.2,88.5 90 top
R6  31.85,74.2 135 top
R7  40.8,72.9 90 top
R9  15.15,89.8 180 top
R10  44.8,77.1 90 top
R11  18.9,80.7 270 top
R12  44,73.9 90 top
R13  15.5,80 180 top
R14  15.45,78.3 0 top
R15  21.43,57.25 270 top
R16  40.4,75.8 180 top
R17  31.9,78.6 0 top
R18  12.8,76.3 270 top
R19  37.2,82 0 top
R20  15.5,91.2 180 top
R21  75.2,63.1 0 top
R22  70.6,73.5 270 top
R23  78.1,84.8 270 top
R24  64.62,86 90 top
R25  63.5,86 90 top
R26  62.45,84.03 180 top
R27  62.45,82.8 180 top
TP1  42.15,87.9 90 top
TP2  47.4,73.2 0 top
TP3  18,76.7 0 top
TP4  48,16.3 180 top
TP5  33,91 0 top
TP6  4.95,91.6 180 top
TP7  78,74.1 0 top
TP8  5,25 0 top
TP9  5.1,74 0 top
TP10  47.4,74.8 0 top
TP11  37.2,87.2 0 top
TP12  50.2,81.6 0 top
TP13  78,64.9 180 top
TP14  50.2,83.5 0 top
TP15  78,91.4 0 top
TP16  43.85,80.1 90 top
TP17  5,35.25 270 top
TP18  5,36.9 270 top
TP19  5,38.55 270 top
TP20  5,40.2 270 top
TP21  5,33.6 90 top
TP22  78,93.2 0 top
TP23  78,16 0 top
TP24  31.8,87.6 180 top
TP25  33.9,83.5 270 top
TP26  17.35,81.7 180 top
TP27  16.7,88.8 0 top
TP28  17.6,83.8 0 top
TP29  17.5,80 180 top
TP30  47.2,64.7 0 top
TP31  78,14 0 top
U1  66.2,92.55 0 top
U2  41.5,15.5 180 top
U3  36.5,73.8 0 top
U4  30.9,83.1 270 top
U7  69.9,81.8 90 top
U10  13.6,83.93 90 top
U11  41.5,65.4 180 top
U12  LTC4412  [SOT23-6']  42.5,82.5 90 top
U$1  30.8,42.6 0 top
U$2  77,5 0 top
U$3  6,94 0 top
U$4  6,5 0 top
X1  77.3,78.4 90 top

### Tracks (layer width: path | path; a pad name or v marks a point on that pad's centre or on a via)
3.3V  (via drill 0.25)
  Top 0.2: v65.4,78.4 65.4,76.8 63.29,74.69 63.29,64.99 v62.9,64.6 | R3.2 R4.2 68,89.2 67.8,89.4 C29.2 | J2.11 16.45,50.35 15.3,51.5 15.3,54.2 14.5,55 14.5,57.88 14.92,58.3 18.45,58.3 18.7,58.05 R15.1 | v66,63.1 R21.1 | U11.2 U11.1
  Top 0.3: U4.6 29.9,82.1 29.6,82.4 C8.1 27.8,82.4 26.7,83.5 v26.7,85.6 | C30.2 75.5,83.5 75.05,83.05 U7.9 73.25,83.05 v73,83.3 | U7.24 67.1,86 65.8,86 v65.5,85.7
  Top 0.4: C29.2 66.8,90.1 66.53,90.38 U1.3
  Top 0.5: C31.2 65.1,78.1 v65.4,78.4 | C25.2 73.84,77.05 v74.25,77.45 | v66.2,85.7 C26.2 66.2,88.3 66.8,88.9 C29.2 67.51,89.4 69.1,90.99 C3.1 | v50.3,51.9 50.3,16.8 46.8,13.3 C1.1 45.4,12.6 44.9,12.1 38.36,12.1 38,12.46 38,14.2 38.35,14.55 U2.1 | 50.3,65.06 v50.3,57.9 | 38.1,61.8 38.1,64.15 38.4,64.45 U11.1 | C5.1 45.4,61.95 45.25,61.8
  Top 1: R15.1 26.07,58.07 29.8,61.8 36.5,61.8 38.1,61.8 45.25,61.8 47.04,61.8 50.3,65.06 52.4,67.16 52.4,80.9 v55.2,83.7 | R20.1 17.4,91.2 v18.2,90.4 v18.7,89.9 v19.2,89.4
  Bottom 0.2: v66,63.1 64.4,63.1 v62.9,64.6
  Bottom 0.5: 74.25,78.63 74.24,78.62 | 55.2,84.9 55.1,85 | v50.3,57.9 v50.3,51.9
  Bottom 0.6: v74.25,78.25 v74.24,78.26 74.24,78.62
  Bottom 1: v74.25,78.25 v74.25,77.45 74.25,79.9 68.6,79.9 67.1,78.4 v65.4,78.4 | 55.2,84.9 v55.2,83.7 v54.8,83.3 v54.4,82.9 | 74.25,78.63 74.25,82.05 v73,83.3 70.6,85.7 v66.2,85.7 v65.5,85.7 61.6,85.7 60.9,85 55.1,85 50.72,89.38 30.48,89.38 v26.7,85.6 26.5,85.4 23.2,85.4 v18.7,89.9 v18.2,90.4
  other vias: 66,78.4
  pour Top (no thermals): 67.2,86.55 67.2,85.25 65.3,85.25 65.3,86.55
  pour Top (isolate 0.2, no thermals): 72.5,76.95 74.8,76.95 74.8,79.15 72.5,79.15
  pour Top (isolate 0.2, no thermals): 64.8,79.15 64.8,77.95 66.3,77.95 66.3,79.15
  pour Top (isolate 0.2, no thermals): 75.8,91.9 68.4,91.9 68.4,93.9 75.8,93.9
4412-CTL
  Top 0.2: Q1.1 Q1.2 Q1.5 | Q1.5 Q1.6 | Q1.5 41.9,84.5 42.6,83.8 42.6,82.1 42.05,81.55 U12.3
4412-GATE
  Top 0.2: Q2.3 45.05,81.55 44.8,81.8 44.8,82.5 | 44.8,82.5 44.8,83.2 45.05,83.45 Q2.1 | U12.5 44.8,82.5
!SHDN-3.3V  (via drill 0.25)
  Top 0.2: v13.7,75.6 R18.2 | v13.67,81.6 13.6,81.67 U10.3
  Top 0.3: TP9.1 D1.A R18.2
  Bottom 0.2: v13.67,81.6 13.67,75.63 v13.7,75.6
!SHDN-OUPUT
  Top 0.2: TP25.1 33.95,83.55 | R19.1 36.1,82 35.9,82.2 Q1.3
  Top 0.3: 33.95,83.55 Q1.3 | D3.A TP25.1
!SHUTDOWN  (via drill 0.25)
  Top 0.2: 8.1,62.3 8.05,62.25 | 8.05,62.25 8,62.2 | 8,62.3 8.05,62.25 | 12,62.3 | J1.2B
  Top 0.3: 18,74 18,72.9 18,66 14.3,62.3 12,62.3 | J1.4B 12,62.3 | J1.4A 12,62.3 | 12,62.3 8.1,62.3 | 8,62.2 J1.2B | J1.2A 8,62.3 | v21.9,78.8 v21.9,78.3 21.9,76.8 19.1,74 18,74 | D1.C 18,74 | D3.C TP11.1 38.33,88.33 CF1.1
  Top 0.5: CF1.2 CF1.1
  Bottom 0.3: v21.9,78.3 21.9,82 23.5,83.6 26.7,83.6 29.6,86.5 36.5,86.5 TP11.1
AUX
  Top 0.2: CF1.7 42.13,87.92 TP1.1
  Top 0.5: CF1.8 CF1.7
BOOT0
  Top 0.2: TP7.1 70.7,74.1 R22.1 70.65,74.25 U7.44
CAN_RX  (via drill 0.25)
  Top 0.2: v68,91.35 67.28,91.35 U1.4 | v64.4,90.7 64.3,90.7 62,88.4 62,86.6 60.38,84.97 60.38,82.03 61.35,81.05 U7.32
  Bottom 0.2: v64.4,90.7 65.05,91.35 v68,91.35
CAN_SHDN  (via drill 0.25)
  Top 0.2: U1.5 67.17,92.78 v67.2,92.75 | v63.9,89.5 62.4,88 62.4,86.5 60.77,84.88 60.77,82.12 61.35,81.55 U7.31
  Bottom 0.2: v63.9,89.5 63.9,90.48 63.89,90.49 63.89,91.09 64.8,92 66.8,92 67.2,92.4 v67.2,92.75
CAN_SILENT  (via drill 0.25)
  Top 0.2: U1.8 64.25,93.85 v63.4,93 | U7.30 61.35,82.05 61.13,82.28 61.13,84.7 62.77,86.35 62.77,87.57 v63.6,88.4
  Bottom 0.2: v63.6,88.4 63.39,88.61 v63.39,92.99 v63.4,93
CAN_TX
  Top 0.2: U1.1 64.1,91.25 61.64,88.79 61.64,86.74 60,85.1 60,81.9 61.35,80.55 U7.33
CANH
  Top 0.2: CF1.9 43.41,88.09 44.45,87.05 49.95,87.05 52.1,84.9 59.3,84.9 61.2,86.8 61.2,91.9 64.1,94.8 65.7,94.8 65.88,94.62 U1.7
  Top 0.5: CF1.10 CF1.9
CANL
  Top 0.2: CF1.11 44.67,88.03 45.15,87.55 50.1,87.55 52.3,85.35 59.25,85.35 60.8,86.9 60.8,92.1 63.9,95.2 66,95.2 66.53,94.67 U1.6
  Top 0.5: CF1.12 CF1.11
DEBU-1/SOLAR3V  (via drill 0.25)
  Top 0.2: v16.1,53.2 16.75,53.85 J2.18
  Top 0.3: J2.18 19.65,53.85 21.44,55.64 R15.2
  Bottom 0.2: TP18.1 9.42,36.9 15.33,42.81 15.33,52.43 v16.1,53.2
DEBUG-0  (via drill 0.25)
  Top 0.2: v16.01,52.39 16.97,53.35 J2.17
  Bottom 0.2: TP17.1 8.27,35.25 15.68,42.66 15.68,52.06 v16.01,52.39
DEBUG-2  (via drill 0.25)
  Top 0.2: v16,53.9 16.45,54.35 J2.19
  Bottom 0.2: TP19.1 10.57,38.55 14.97,42.95 14.97,52.88 v16,53.9
DEBUG-3  (via drill 0.25)
  Top 0.2: v16.1,54.8 16.15,54.85 J2.20
  Bottom 0.2: TP20.1 11.72,40.2 14.6,43.08 14.6,53.4 16,54.8 v16.1,54.8
GND  (via drill 0.25)
  Top 0.2: C28.2 76.6,77.5 X1.4 | 11.22,84.13 U10.14 | U10.12 11.23,83.33 | U10.16 15.77,83.33 | U10.17 15.7,83.73 | U10.18 15.77,84.13 | U10.19 15.77,84.53 | U10.15 11.17,84.53 | U10.13 11.2,83.73 | U2.2 37.75,15.5
  Top 0.28: U10.7 14.1,83.9
  Top 0.3: v66.9,79.6 66.85,79.55 U7.35 63.9,79.55 C31.1 | 73.05,82.55 U7.8 75.15,82.55 | 72.15,76.65 U7.47 72.15,78.65 | 67.65,84.85 U7.23 67.65,87.75 C26.1 | 72.15,78.65 v72,78.8 | 72.15,78.65 72.15,79.45
  Top 0.5: U11.5 C5.2 | U2.5 v45.4,15.5
  other vias: 9.8,88.9 9.8,90.9 9.9,89.9 10,91.9 10.4,87.2 10.3,80.1 9.8,79.3 9.8,78.6 9.8,77.8 22.4,84.2 19.1,85 39.6,90.4 39.6,88.3 39.6,87.7 39.6,87.1 39.6,92.1 19.9,81.4 34.7,90.53 37.2,90.5 45.8,88.1 45.65,90.55 48.3,90.7 53.6,92.5 45.8,86.5 50.8,85.4 51.9,86.5 81,90 81,80 81,70 81,60 81,50 81,40 81,30 81,20 81,10 2,90 2,84 2,80 2,76 2,70 2,60 2,54 2,50 2,44 2,40 2,26 2,20 2,16 2,10 10.9,94.1 77.5,94.7 35.1,56.6 66.2,59.7 21,29.5 22,29.5 23,29.5 24,29.5 25,29.5 26,29.5 27,29.5 28,29.5 34,29.5 35,29.5 36,29.5 37,29.5 38,29.5 44,29.5 45,29.5 46,29.5 47,29.5 48,29.5 25,28.5 24.5,27.5 10.97,76.9 40,81.7 42,80.2 46.2,80.1 45.5,84.8 42.9,84.8 66.8,84.1 9.8,92.9 42.3,76.7 47.2,76.3 34.3,72.1 33.3,72.7 30.65,75.3 29.8,76.1 33,76.2 39.8,79.2 69.7,84.7 66.9,87.1 76.6,75.2 66.2,92.55 78.1,81.57 78.9,79.2 75.8,76.1 67.5,84.77 66.9,82.1 71.3,81.1 74.8,85.43 21.7,44.5 19.7,47.5 17.5,41.9 68.4,88.4 25,30.5 24.5,31.5 26,32.5 25,33.5 26,34.5 25,35.5 26,36.5 25,37.5 26,38.5 25,39.5 62.9,79.5 46.4,14.7 70.6,72 19.7,41.5 45.2,44.7 42,41.3 35.3,44.5 42,47.6 36.2,56.6 37.1,57.4 34.2,57.4 46.4,65.4 77,61.3 44,72.4 35.3,72.5 44.9,73.2 41.8,72.6 31.9,84.1 31.4,84.1 28.5,84.6 39.6,93.8 78.1,90.1 72.4,82.6 77.1,82.13 75.8,79.93 75.7,77.6 45.2,75 25.5,46.5 24.5,48.5 25.5,47.5 25.5,53.5 24.5,52.5 25.5,51.5 24.5,46.5 24.5,47.5 25.5,48.5 24.5,51.5 25.5,52.5 24.5,53.5 58.5,46.5 57.5,48.5 58.5,47.5 58.5,53.5 57.5,52.5 58.5,51.5 57.5,46.5 57.5,47.5 58.5,48.5 57.5,51.5 58.5,52.5 57.5,53.5 26,39.5 25,38.5 26,37.5 25,36.5 26,35.5 25,34.5 26,33.5 25,32.5 25.5,31.5 24,30.5 24,28.5 23,28.5 21,28.5 21,30.5 22,30.5 23,30.5 22,28.5 23.5,27.5 25.5,27.5 26.5,27.5 26,28.5 26,30.5 27,30.5 27,28.5 28,28.5 28,30.5 34,30.5 34,28.5 35,28.5 35,30.5 36,30.5 36,28.5 37,28.5 37,30.5 38,30.5 38,28.5 44,28.5 45,28.5 46,28.5 47,28.5 48,28.5 48,30.5 47,30.5 46,30.5 45,30.5 44,30.5 8.5,29.5 9.5,29.5 10.5,29.5 11.5,29.5 12.5,29.5 13.5,29.5 14.5,29.5 15.5,29.5 12.5,28.5 12.5,30.5 11.5,30.5 11.5,28.5 10.5,28.5 8.5,28.5 8.5,30.5 9.5,30.5 10.5,30.5 9.5,28.5 13.5,28.5 13.5,30.5 14.5,30.5 14.5,28.5 15.5,28.5 15.5,30.5 23.5,31.5 24,33.5 24,35.5 24,37.5 24,39.5 24,38.5 24,36.5 24,34.5 24,32.5 25,18.5 26,19.5 25,20.5 26,21.5 25,22.5 26,23.5 25,24.5 26,25.5 25,26.5 26,26.5 25,25.5 26,24.5 25,23.5 26,22.5 25,21.5 26,20.5 25,19.5 26,18.5 24,18.5 24,20.5 24,22.5 24,24.5 24,26.5 24,25.5 24,23.5 24,21.5 24,19.5 39,29.5 39,30.5 39,28.5 49,29.5 49,28.5 49,30.5 29,28.5 29,29.5 29,30.5 26.5,31.5 54,29.5 55,29.5 56,29.5 57,29.5 58,29.5 59,29.5 60,29.5 61,29.5 58,28.5 57.5,27.5 58,30.5 57.5,31.5 59,32.5 58,33.5 59,34.5 58,35.5 59,36.5 58,37.5 59,38.5 58,39.5 59,39.5 58,38.5 59,37.5 58,36.5 59,35.5 58,34.5 59,33.5 58,32.5 58.5,31.5 57,30.5 57,28.5 56,28.5 54,28.5 54,30.5 55,30.5 56,30.5 55,28.5 56.5,27.5 58.5,27.5 59.5,27.5 59,28.5 59,30.5 60,30.5 60,28.5 61,28.5 61,30.5 56.5,31.5 57,33.5 57,35.5 57,37.5 57,39.5 57,38.5 57,36.5 57,34.5 57,32.5 58,18.5 59,19.5 58,20.5 59,21.5 58,22.5 59,23.5 58,24.5 59,25.5 58,26.5 59,26.5 58,25.5 59,24.5 58,23.5 59,22.5 58,21.5 59,20.5 58,19.5 59,18.5 57,18.5 57,20.5 57,22.5 57,24.5 57,26.5 57,25.5 57,23.5 57,21.5 57,19.5 62,28.5 62,29.5 62,30.5 59.5,31.5 54,69.5 55,69.5 56,69.5 57,69.5 58,69.5 59,69.5 60,69.5 61,69.5 58,68.5 57.5,67.5 58,70.5 57.5,71.5 59,72.5 58,73.5 59,74.5 58,75.5 59,76.5 58,77.5 59,78.5 58,79.5 59,79.5 58,78.5 59,77.5 58,76.5 59,75.5 58,74.5 59,73.5 58,72.5 58.5,71.5 57,70.5 57,68.5 56,68.5 54,68.5 54,70.5 55,70.5 56,70.5 55,68.5 56.5,67.5 58.5,67.5 59.5,67.5 59,68.5 59,70.5 60,70.5 60,68.5 61,68.5 61,70.5 56.5,71.5 57,73.5 57,75.5 57,77.5 57,79.5 57,78.5 57,76.5 57,74.5 57,72.5 58,60.5 59,61.5 58,62.5 59,63.5 58,64.5 59,65.5 58,66.5 59,66.5 58,65.5 59,64.5 58,63.5 59,62.5 58,61.5 59,60.5 57,60.5 57,62.5 57,64.5 57,66.5 57,65.5 57,63.5 57,61.5 62,68.5 62,69.5 62,70.5 59.5,71.5 21,69.5 22,69.5 23,69.5 24,69.5 25,69.5 26,69.5 27,69.5 28,69.5 25,68.5 24.5,67.5 25,70.5 24.5,71.5 26,72.5 25,73.5 26,74.5 25,75.5 26,76.5 25,77.5 26,78.5 25,79.5 26,79.5 25,78.5 26,77.5 25,76.5 26,75.5 25,74.5 26,73.5 25,72.5 25.5,71.5 24,70.5 24,68.5 23,68.5 21,68.5 21,70.5 22,70.5 23,70.5 22,68.5 23.5,67.5 25.5,67.5 26.5,67.5 26,68.5 26,70.5 27,70.5 27,68.5 28,68.5 28,70.5 23.5,71.5 24,73.5 24,75.5 24,77.5 24,79.5 24,78.5 24,76.5 24,74.5 24,72.5 25,60.5 26,61.5 25,62.5 26,63.5 25,64.5 26,65.5 25,66.5 26,66.5 25,65.5 26,64.5 25,63.5 26,62.5 25,61.5 26,60.5 24,60.5 24,62.5 24,64.5 24,66.5 24,65.5 24,63.5 24,61.5 29,68.5 29,69.5 29,70.5 26.5,71.5 34,69.5 35,69.5 36,69.5 37,69.5 38,69.5 44,69.5 45,69.5 46,69.5 47,69.5 48,69.5 34,70.5 34,68.5 35,68.5 35,70.5 36,70.5 36,68.5 37,68.5 37,70.5 38,70.5 38,68.5 46,68.5 47,68.5 48,68.5 48,70.5 47,70.5 46,70.5 45,70.5 44,70.5 39,69.5 39,70.5 49,69.5 49,68.5 49,70.5 5.5,29.5 6.5,29.5 7.5,29.5 7.5,28.5 5.5,28.5 5.5,30.5 6.5,30.5 7.5,30.5 6.5,28.5 25,4.5 25,5.5 25,6.5 25,7.5 25,8.5 25,9.5 25,10.5 25,11.5 26,8.5 24,8.5 24,7.5 26,7.5 26,6.5 26,4.5 24,4.5 24,5.5 24,6.5 26,5.5 26,9.5 24,9.5 24,10.5 26,10.5 26,11.5 24,11.5 25,2.5 25,3.5 26,3.5 24,2.5 24,3.5 26,2.5 58,4.5 58,5.5 58,6.5 58,7.5 58,8.5 58,9.5 58,10.5 58,11.5 59,8.5 57,8.5 57,7.5 59,7.5 59,6.5 59,4.5 57,4.5 57,5.5 57,6.5 59,5.5 59,9.5 57,9.5 57,10.5 59,10.5 59,11.5 57,11.5 58,2.5 58,3.5 59,3.5 57,2.5 57,3.5 59,2.5 69.5,29.5 70.5,29.5 71.5,29.5 72.5,29.5 73.5,29.5 74.5,29.5 75.5,29.5 76.5,29.5 73.5,28.5 73.5,30.5 72.5,30.5 72.5,28.5 71.5,28.5 69.5,28.5 69.5,30.5 70.5,30.5 71.5,30.5 70.5,28.5 74.5,28.5 74.5,30.5 75.5,30.5 75.5,28.5 76.5,28.5 76.5,30.5 66.5,29.5 67.5,29.5 68.5,29.5 68.5,28.5 66.5,28.5 66.5,30.5 67.5,30.5 68.5,30.5 67.5,28.5 25,89.5 25,90.5 25,91.5 25,92.5 25,93.5 25,94.5 25,95.5 26,93.5 24,93.5 24,92.5 26,92.5 26,91.5 26,89.5 24,89.5 24,90.5 24,91.5 26,90.5 26,94.5 24,94.5 24,95.5 26,95.5 25,86.5 25,87.5 25,88.5 26,88.5 26,86.5 24,86.5 24,87.5 24,88.5 26,87.5 8.5,69.5 9.5,69.5 10.5,69.5 11.5,69.5 12.5,69.5 13.5,69.5 14.5,69.5 15.5,69.5 12.5,68.5 12.5,70.5 11.5,70.5 11.5,68.5 10.5,68.5 8.5,68.5 8.5,70.5 9.5,70.5 10.5,70.5 9.5,68.5 13.5,68.5 13.5,70.5 14.5,70.5 14.5,68.5 15.5,68.5 15.5,70.5 5.5,69.5 6.5,69.5 7.5,69.5 7.5,68.5 5.5,68.5 5.5,70.5 6.5,70.5 7.5,70.5 6.5,68.5 58,89.5 58,90.5 58,91.5 58,92.5 58,93.5 58,94.5 58,95.5 59,93.5 57,93.5 57,92.5 59,92.5 59,91.5 59,89.5 57,89.5 57,90.5 57,91.5 59,90.5 59,94.5 57,94.5 57,95.5 59,95.5 58,86.5 58,87.5 58,88.5 59,88.5 59,86.5 57,86.5 57,87.5 57,88.5 59,87.5 69.5,69.5 70.5,69.5 71.5,69.5 72.5,69.5 73.5,69.5 74.5,69.5 75.5,69.5 76.5,69.5 73.5,68.5 73.5,70.5 72.5,70.5 72.5,68.5 71.5,68.5 69.5,68.5 69.5,70.5 70.5,70.5 71.5,70.5 70.5,68.5 74.5,68.5 74.5,70.5 75.5,70.5 75.5,68.5 76.5,68.5 76.5,70.5 66.5,69.5 67.5,69.5 68.5,69.5 68.5,68.5 66.5,68.5 66.5,70.5 67.5,70.5 68.5,70.5 67.5,68.5 77.5,68.5 77.5,69.5 77.5,70.5 77.5,28.5 77.5,29.5 77.5,30.5 57,1.5 58,1.5 59,1.5 24,1.5 25,1.5 26,1.5 27,2.5 16,1.5 17,1.5 18,1.5 19,1.5 20,1.5 21,1.5 22,1.5 23,1.5 20,2.5 19,2.5 16,2.5 17,2.5 18,2.5 21,2.5 22,2.5 23,2.5 13,1.5 14,1.5 15,1.5 13,2.5 14,2.5 15,2.5 31,1.5 32,1.5 33,1.5 34,1.5 35,1.5 36,1.5 37,1.5 35,2.5 34,2.5 31,2.5 32,2.5 33,2.5 36,2.5 37,2.5 28,1.5 29,1.5 30,1.5 28,2.5 29,2.5 30,2.5 27,1.5 9,1.5 10,1.5 11,1.5 12,1.5 12,2.5 9,2.5 10,2.5 11,2.5 6,1.5 7,1.5 8,1.5 6,2.5 7,2.5 8,2.5 49,1.5 50,1.5 51,1.5 52,1.5 53,1.5 54,1.5 55,1.5 56,1.5 53,2.5 52,2.5 49,2.5 50,2.5 51,2.5 54,2.5 55,2.5 56,2.5 46,1.5 47,1.5 48,1.5 46,2.5 47,2.5 48,2.5 42,1.5 43,1.5 44,1.5 45,1.5 45,2.5 42,2.5 43,2.5 44,2.5 39,1.5 40,1.5 41,1.5 39,2.5 40,2.5 41,2.5 70,1.5 71,1.5 72,1.5 73,1.5 74,1.5 75,1.5 76,1.5 77,1.5 74,2.5 73,2.5 70,2.5 71,2.5 72,2.5 75,2.5 76,2.5 77,2.5 67,1.5 68,1.5 69,1.5 67,2.5 68,2.5 69,2.5 63,1.5 64,1.5 65,1.5 66,1.5 66,2.5 63,2.5 64,2.5 65,2.5 60,1.5 61,1.5 62,1.5 60,2.5 61,2.5 62,2.5 38,2.5 38,1.5 25,97.5 24,97.5 26,97.5 58,97.5 57,97.5 59,97.5 57,96.5 58,96.5 59,96.5 24,96.5 25,96.5 26,96.5 27,97.5 16,96.5 17,96.5 18,96.5 19,96.5 20,96.5 21,96.5 22,96.5 23,96.5 20,97.5 19,97.5 16,97.5 17,97.5 18,97.5 21,97.5 22,97.5 23,97.5 13,96.5 14,96.5 15,96.5 13,97.5 14,97.5 15,97.5 31,96.5 32,96.5 33,96.5 34,96.5 35,96.5 36,96.5 37,96.5 35,97.5 34,97.5 31,97.5 32,97.5 33,97.5 36,97.5 37,97.5 28,96.5 29,96.5 30,96.5 28,97.5 29,97.5 30,97.5 27,96.5 9,96.5 10,96.5 11,96.5 12,96.5 12,97.5 9,97.5 10,97.5 11,97.5 6,96.5 7,96.5 8,96.5 6,97.5 7,97.5 8,97.5 49,96.5 50,96.5 51,96.5 52,96.5 53,96.5 54,96.5 55,96.5 56,96.5 53,97.5 52,97.5 49,97.5 50,97.5 51,97.5 54,97.5 55,97.5 56,97.5 46,96.5 47,96.5 48,96.5 46,97.5 47,97.5 48,97.5 42,96.5 43,96.5 44,96.5 45,96.5 45,97.5 42,97.5 43,97.5 44,97.5 39,96.5 40,96.5 41,96.5 39,97.5 40,97.5 41,97.5 70,96.5 71,96.5 72,96.5 73,96.5 74,96.5 75,96.5 76,96.5 77,96.5 74,97.5 73,97.5 70,97.5 71,97.5 72,97.5 75,97.5 76,97.5 77,97.5 67,96.5 68,96.5 69,96.5 67,97.5 68,97.5 69,97.5 63,96.5 64,96.5 65,96.5 66,96.5 66,97.5 63,97.5 64,97.5 65,97.5 60,96.5 61,96.5 62,96.5 60,97.5 61,97.5 62,97.5 38,97.5 38,96.5 2,92 2,88 2,86 2,82 2,78 2,74 2,72 2,68 2,62 2,58 2,56 2,52 2,48 2,46 2,42 2,38 2,32 2,30 2,28 2,24 2,22 2,18 2,14 2,12 2,8 2,2 4,2 2,98 4,98 79,98 81,98 81,92 81,88 81,86 81,84 81,82 81,78 81,76 81,74 81,72 81,68 81,62 81,58 81,56 81,54 81,52 81,48 81,46 81,44 81,42 81,38 81,32 81,28 81,26 81,24 81,22 81,18 81,16 81,14 81,12 81,8 81,2 79,2 9,61 10,61 10,64 6,64 6,61 62.2,44.5 67.2,44.5 66.7,55.4 67.5,58.5 66.7,38 66.4,65.6 33,51.2 32.9,48.8 37.3,41.4 37.3,47.6 75.9,87.7 72.9,87.2 74,91.3 69.2,90 64.6,89.4 37.7,15.5 62.5,84.67 64.62,87.58 19.3,49.4 17,49.2 17.1,47.8 17,46.3 29.4,60.1 47.9,58.4 51.3,58.5 53.5,60.3 18.1,86.4 17.8,88.8 18.8,87.5 13.1,84.45 14.15,84.4 13.07,83.42 14.12,83.4 13.6,83.9 16,84.2 11.2,83.5 46.4,64 46.8,65.7 37.7,17.1 61.8,89.85 63.52,87.58 9.9,87.9 9.8,84 16,83.6 11.18,84.28 20.3,86.9 16.2,81.9 18.9,82.2 20.1,76.8 15.8,75.6 11.9,81.3 15.7,92.4 24.9,82.7 71.2,88.5
  pour Bottom (isolate 0.2, rank 6): 81,0 2,0 arc-90 0,2 0,98 arc-90 2,100 81,100 arc-90 83,98 83,2 arc-90
  pour Top (isolate 0.2, rank 6): 81,0 2,0 arc-90 0,2 0,98 arc-90 2,100 81,100 arc-90 83,98 83,2 arc-90
INTERCELL
  Bottom 1.5: CELL2.NEG1 18.75,51.65 20.4,50 29.5,50 | 41,50 29.5,50 | 41,50 CELL2.NEG4 | 41,50 45.7,50 | 45.7,50 CELL2.NEG3 | 45.7,50 53.5,50 | CELL1.POS1 53.5,50 | CELL2.NEG2 63.3,55.45 63.3,51.9 61.4,50 53.5,50 | CELL1.POS2 29.5,50
LT1618-ENABLE  (via drill 0.25)
  Top 0.2: U3.9 40.47,74.3 40.8,73.97 R7.2 41.99,73.59 42.2,73.8 v42.8,73.8 | U7.11 72.5,84.05 71.6,83.15 v71.6,82.6
  Bottom 0.2: v42.8,73.8 43.2,74.2 46.8,74.2 TP10.1 49.5,74.8 56.2,81.5 70.5,81.5 v71.6,82.6
LT1618-FB  (via drill 0.25)
  Top 0.3: R10.1 44.8,75.9 44,75.1 R12.2 43,74.6 42.8,74.4 v41.3,74.4 | v35.4,74.8 U3.1
  Bottom 0.3: v41.3,74.4 35.8,74.4 v35.4,74.8
LT1618-IADJ  (via drill 0.25)
  Top 0.2: U7.14 72.15,85.19 67.86,80.9 v67,80.9 | R6.1 32.75,73.3 U3.4 35.6,73.3 v35.6,73.24
  Bottom 0.2: v35.6,73.24 43.04,73.24 43.6,73.8 46.8,73.8 TP2.1 48.7,73.2 56.4,80.9 v67,80.9
LT1618-ISN
  Top 0.152: U3.2 33.7,74.3 32.1,75.9 32.1,77.8 32.7,78.4 R17.2 32.7,78.8 32.2,79.3 32.2,79.47 32.4,79.67 32.4,81.6 32.1,81.9 31.7,81.9 31.4,81.6 U4.9
  Top 0.2: U4.9 U4.8 30.9,82.1 33,84.2 TP5.1
  Top 1: R17.2 34.4,78.6 L2.P$1
LT1618-SW
  Top 0.3: U3.7 37.2,73.3 36.3,74.2 36.3,77.8 36.9,78.4 L2.P$2
  Top 0.7: D5.A 38.6,77.8 L2.P$2
LT1618-VC
  Top 0.2: U3.10 39.4,74.8 39.7,75.1 R16.2
N$1  (via drill 0.25)
  Top 0.2: v16.54,45.3 16.59,45.35 J2.1 J2.2
  Bottom 0.2: TP8.1 4.4,25.6 4.4,30.39 16.54,42.52 v16.54,45.3
N$2
  Top 0.2: U2.6 43.95,14.55 44.5,14 45,14 46.7,14 48,15.3 TP4.1
N$7
  Top 0.2: U4.3 30.9,86.3 31.8,87.2 TP24.1
N$9
  Top 0.2: U11.6 44.15,64.45 44.4,64.7 TP30.1
N$10
  Top 0.3: C2.1 R16.1
N$11
  Top 0.2: U12.4 43.81,80.14 TP16.1
N$13
  Top 0.7: Q2.5 Q2.2
N$14  (via drill 0.25)
  Top 0.2: R21.2 v76.9,63.1
  Bottom 0.2: v76.9,63.1 77.98,63.1 D4.A
N$19  (via drill 0.25)
  Top 0.2: R23.1 v78.1,86.3
  Bottom 0.2: v78.1,86.3 D6.A
NRESET  (via drill 0.25)
  Top 0.2: 65.3,64.9 65.3,62.71 57.18,54.59 23.29,54.59 19.7,51 19.7,50.5 19.05,49.85 J2.10 | 65.3,64.9 65.3,71.5 v69.9,76.1 | U7.7 71.05,82.05 70.3,81.3 v70.3,78.9 | TP13.1 65.3,64.9
  Bottom 0.2: v70.3,78.9 70.3,76.5 v69.9,76.1
PA0
  Top 0.2: U7.10 74.85,83.55 75.4,84.1 R23.2
PA2/USART2_TX  (via drill 0.25)
  Top 0.2: U7.12 72.5,84.55 69.6,81.64 v69.6,78.9 | v68.6,75.71 67.68,75.71 64.5,72.53 64.5,63 56.79,55.3 23,55.3 19.05,51.35 J2.13
  Bottom 0.2: v68.6,75.71 69.6,76.72 v69.6,78.9
PA3/USART2_RX  (via drill 0.25)
  Top 0.2: U7.13 72.65,85.19 68.91,81.45 v68.91,78.91 v68.9,78.9 | v68,75.1 64.9,72 64.9,62.91 56.94,54.94 23.14,54.94 19.05,50.85 J2.12
  Bottom 0.2: v68.9,78.9 68.9,78.3 68,77.4 v68,75.1
PA5  (via drill 0.25)
  Top 0.2: U7.15 v71.65,87.09 v71.66,87.1
  Bottom 0.2: v71.66,87.1 75.96,91.4 TP15.1
PA6  (via drill 0.25)
  Top 0.2: U7.16 v71.15,87.55
  Bottom 0.2: v71.15,87.55 76.8,93.2 TP22.1
SCL  (via drill 0.25)
  Top 0.2: v67.8,82.8 68.65,83.65 U7.21 68.65,86.75 68.83,86.92 70.03,86.92 70.3,87.2 R3.1 | U4.5 29.48,85.3 v29.24,85.06 | TP31.1 77.9,14.1 49.3,14.1 | 49.3,14.1 49.05,14.1 46.15,11.2 37.85,11.2 36.3,12.75 36.3,17.8 42.6,24.1 42.6,31.2 48.7,37.3 v48.7,52.2 | v51.4,78.9 51.4,67.8 v48.7,65.1 47.45,66.35 U11.4 | v48.7,62.15 v48.7,57.2 | v49.3,13.45 49.3,14.1 | U2.4 v45.3,16.45
  Bottom 0.2: v29.24,85.06 29.24,84.44 31.34,82.34 47.26,82.34 50.7,78.9 v51.4,78.9 52.3,78.9 56.2,82.8 v67.8,82.8 | v48.7,65.1 v48.7,62.15 | v48.7,57.2 v48.7,52.2 | v45.3,16.45 46.3,16.45 v49.3,13.45
SDA  (via drill 0.25)
  Top 0.2: v67.4,83.4 68.15,84.15 U7.22 68.15,86.75 68.7,87.3 69.1,87.3 69.2,87.4 R4.1 | U4.4 v30.4,84.1 | TP23.1 76.9,16 75.4,14.5 48.8,14.5 45.9,11.6 37.95,11.6 36.65,12.9 36.65,16.45 | v49.3,66.6 50.8,68.1 v50.8,80.5 | v49.3,61.35 v49.3,57.7 | v49.3,51.6 49.3,37.3 43.05,31.05 43.05,24.05 36.65,17.65 36.65,16.45 | U11.3 38.25,66.35 v38.1,66.2 | U2.3 36.65,16.45
  Bottom 0.2: v30.4,84.1 31.8,82.7 33.56,82.7 33.57,82.69 47.41,82.69 49.6,80.5 v50.8,80.5 53.3,80.5 56.2,83.4 v67.4,83.4 | v49.3,57.7 v49.3,51.6 | v49.3,66.6 v49.3,61.35 38.75,61.35 38.1,62 v38.1,66.2
SMSN0
  Top 0.2: U7.25 64.85,84.55 64.62,84.78 R24.1
SMSN1
  Top 0.2: U7.26 64.17,84.05 63.5,84.72 R25.1
SMSN2
  Top 0.2: R26.1 63.58,84.03 64.05,83.55 U7.27
SMSN3
  Top 0.2: R27.1 64.3,82.8 64.55,83.05 U7.28
SWCLK
  Top 0.2: U7.37 66.65,77.55 63.7,74.6 63.7,63.4 56.3,56 22.7,56 19.05,52.35 J2.15
SWDIO  (via drill 0.25)
  Top 0.2: U7.34 64.32,80.05 62.55,80.05 62.2,79.7 v62.2,75.9 | v64.3,73.8 64.09,73.59 64.09,63.2 56.55,55.65 22.85,55.65 19.05,51.85 18.3,51.85 J2.14
  Bottom 0.2: v64.3,73.8 v62.2,75.9
SWO  (via drill 0.25)
  Top 0.2: v16.19,51.73 16.19,51.74 17.29,52.85 J2.16
  Bottom 0.2: TP21.1 7.12,33.6 16.03,42.52 16.03,51.58 v16.19,51.73
TPS-EN
  Top 0.2: U10.4 14.1,81.89 14.48,81.5 15.7,81.5 16.2,81 R13.1 TP29.1 R11.2
TPS-FB
  Top 0.2: U10.8 13.6,85.9 14.1,86.4 R2.2 15.9,87.4 R1.1 C22.1 16.6,88.7 TP27.1
TPS-L1
  pour Top (isolate 0.2, no thermals): 9.15,83.1 10.4,83.1 10.6,82.9 12.71,82.9 12.66,82 9.15,82
TPS-L2
  pour Top (isolate 0.2, no thermals): 12.75,84.9 9.15,84.9 9.15,85.8 12.75,85.8
TPS-PG
  Top 0.2: R9.1 17.7,89.8 19.7,87.8 19.7,83.75 18.4,82.45 17.35,82.45 | TP26.1 17.35,82.45 | 17.35,82.45 U10.5
TPS-VAUX
  Top 0.2: U10.6 15.7,85.41 16.1,85 C7.1 16.9,84.8 16.9,84.5 TP28.1
TPS-VIN
  Top 0.2: R18.1 12.8,78.4 C12.1
  Top 0.28: U10.2 13.1,80.6
  pour Top (isolate 0.2, rank 2, no thermals): 12.75,81.2 12.15,80.6 12.15,76.6 15.15,76.6 15.15,81.2
TPS-VOUT-3.3V
  Top 0.28: U10.9 13.1,86.4
  Top 0.3: TP6.1 6.15,91.6 9.35,94.8 11.9,94.8 12.7,94 C23.1
  pour Top (isolate 0.2, rank 2, no thermals): 12.95,86.1 12.4,86.65 12.15,86.65 12.15,93.7 15.15,93.7 15.15,86.1
VBUS
  Top 0.2: Q2.6 48.45,83.5 TP14.1
  Top 0.3: 43.7,85.7 43.7,83.56 U12.6
  Top 0.5: CF1.6 CF1.5
  Top 0.7: Q2.6 48.4,84.42 47.12,85.7 43.7,85.7 42.59,85.7 40.87,87.42 CF1.5
VMPPT
  Top 0.2: Q2.4 50.15,81.55 TP12.1
  Top 0.3: U12.1 39.85,83.45 | C21.1 38.55,83.5 38.55,82.25 38.5,82.2 | D5.K 42,77.8 41.4,78.4 41.4,79.3 38.5,82.2 | R19.2 38.3,82 38.5,82.2
  Top 0.4: 39.85,83.45 C21.1 | 38.55,83.5 Q1.4
  Top 0.7: Q2.4 48.4,79.75 46.45,77.8 C18.1 R10.2 D5.K
VSOLAR  (via drill 0.25)
  Top 0.152: U3.3 33.61,73.8 31.7,75.71 31.7,77.8 31.1,78.4 R17.1 31.1,78.8 31.9,79.6 U4.10
  Top 0.2: C4.1 v35.1,59.6 | C6.1 36.1,58.8 v36.1,59.6 | v36.1,59.6 v35.1,59.6 | v35.1,59.6 v35.1,60.3 v36.1,60.3 v36.1,59.6 | v39.7,73.8 v39.7,73.79 | R14.2 17.4,78.3 v17.65,78.05 18.1,78.5 18.3,78.5 v18.3,78.62 v17.68,78.62 18.25,78.05 v18.27,78.05
  Top 0.3: U3.8 v39.7,73.8 | v31.1,77.3 R17.1
  Top 0.75: R14.2 17.45,78.3
  Top 1.5: 29.1,79.1 26.9,81.3 22.45,81.3 19.45,78.3 17.45,78.3
  Bottom 0.2: v35.1,59.6 33,59.6 33,60 | v18.27,78.05 18.25,78.05 18,78.3
  Bottom 0.3: v39.7,73.79 33.51,73.79 31.1,76.2 v31.1,77.3
  Bottom 1.5: CELL2.POS2 53.5,58.65 52.15,60 48.6,60 33,60 31,60 29.5,58.5 CELL2.POS1 25.5,55.5 18,63 TP3.1 18,78.3
  pour Top (isolate 0.2, no thermals): 36.9,58.3 34.4,58.3 34.4,60.8 36.9,60.8
  pour Top (isolate 0.2, no thermals): 31.5,78 31.5,79.9 28.3,79.9 28.3,78
XTAL1-IN
  Top 0.2: U7.5 74.77,81.05 75.17,80.65 75.17,79.28 76.05,78.4 77.45,78.4 77.92,77.92 X1.1 77.92,76.92 78,76.85 C28.1
XTAL1-OUT
  Top 0.2: X1.3 76.6,79.3 C27.1 75.75,80.7 74.9,81.55 U7.6

### Text on the board
tPlace: PA6 | 3.3V | PA5 | !SHDN | VBUS | VMPPT | !SHDN-3.3V | VSOLAR | LT-EN | IADJ | BOOT0 | NRST | POPULATE ON / +Z+X SOLAR / BOARD ONLY | D3 | D2 | D1 | D0 | SWO | VBUSP | SDA | SCL | OreSat Solar Module v5.3 | 2021/04/09 | Frame v1.1 | David Lay (dalay@pdx.edu)
bPlace: PA6 | PA5 | 3.3V | PA0 | !SHDN-3.3V | BOOT0 | NRST | 3.3V | OreSat Solar Module v5.3 | Frame v1.1 | 2021/04/09 | D3 | D2 | D1 | D0 | SDO | VBUSP | SDA | SCL
tDocu: NOTE: See DXF layer for component / placement restrictions